# EAGLE design Charger Control Board rev8 (EAGLE 9.6.2)

## Sheet 1 of 3: Main
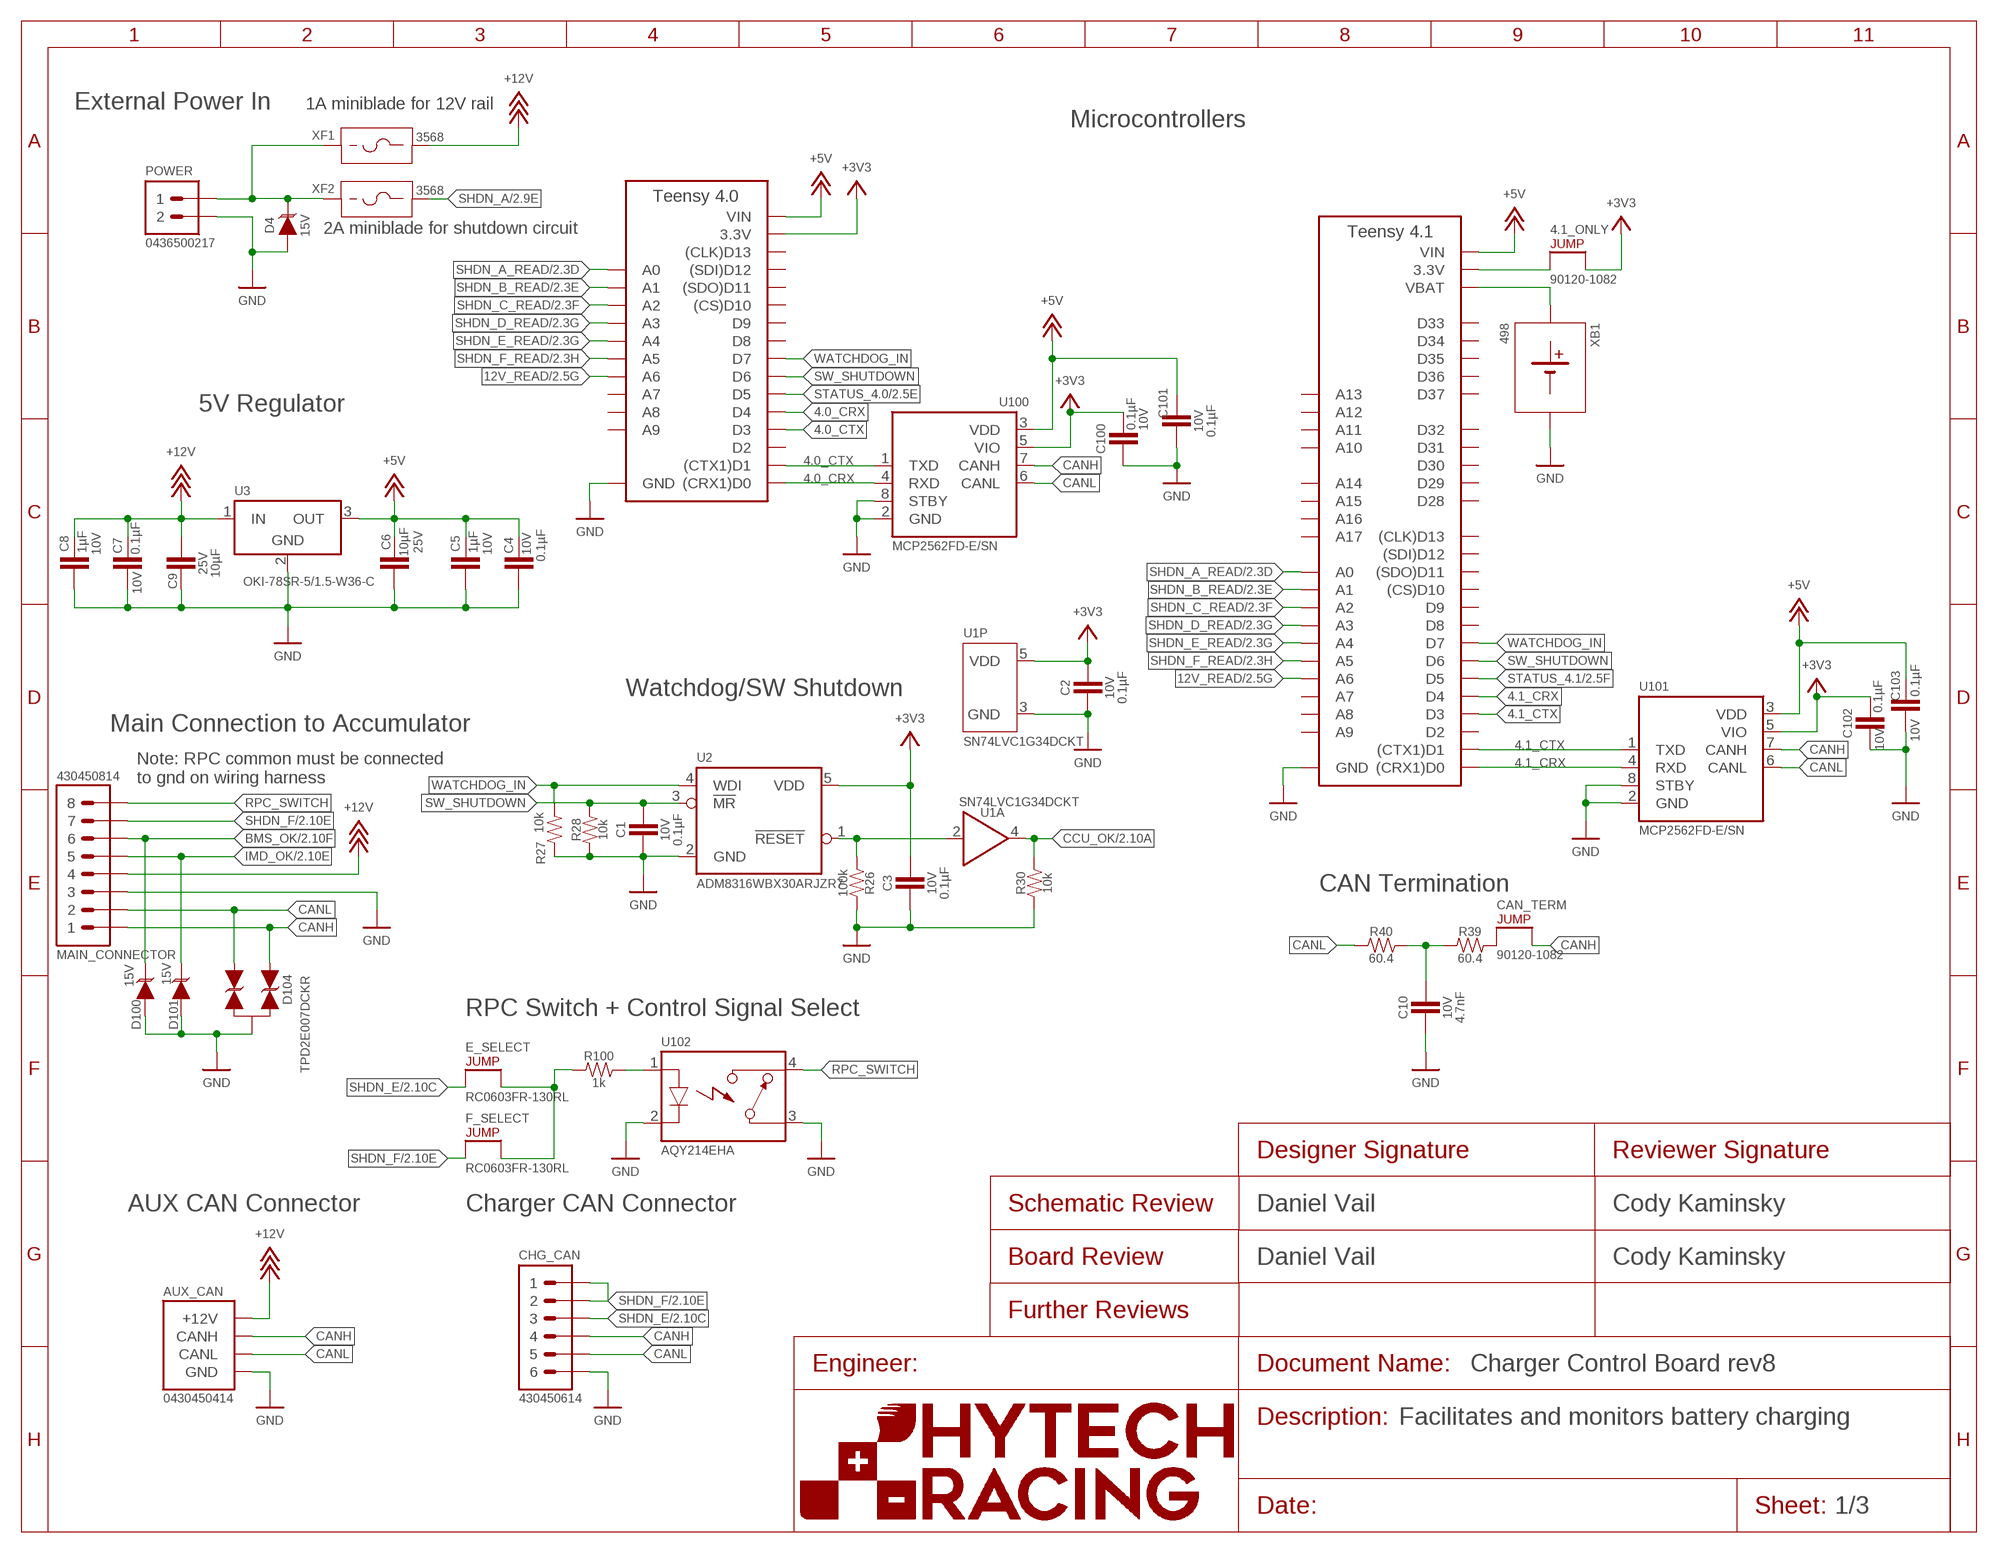
[diagram p0: schematic, sheet 1]
FRAME1 (FRAME): DESCRIPTION_1: Facilitates and monitors battery charging; DESIGNER_BOARD: Daniel Vail; DESIGNER_SCHEMATIC: Daniel Vail; REVIEWER_BOARD: Cody Kaminsky; REVIEWER_SCHEMATIC: Cody Kaminsky

### Parts
4.1_ONLY  JUMPER__1X02  [1X02]
A1  TEENSY_4.1  [TEENSY_LONG_EXT]
A2  TEENSY_4.0  [TEENSY_SHORT]
AUX_CAN  CONNECTOR-CAN_MF_T_V_BLACK  [MOLEX_MICROFIT_PTH_VERTICAL_04_DUAL]
C1  CAPACITOR_0603_10V_0.1UF  [0603-CAP]
C2  CAPACITOR_0603_10V_0.1UF  [0603-CAP]
C3  CAPACITOR_0603_10V_0.1UF  [0603-CAP]
C4  CAPACITOR_0603_10V_0.1UF  [0603-CAP]
C5  CAPACITOR_0603_10V_1UF  [0603-CAP]
C6  CAPACITOR_0603_25V_10UF  [0603-CAP]
C7  CAPACITOR_0603_10V_0.1UF  [0603-CAP]
C8  CAPACITOR_0603_10V_1UF  [0603-CAP]
C9  CAPACITOR_0603_25V_10UF  [0603-CAP]
C10  CAPACITOR_0603_10V_4.7NF  [0603-CAP]
C100  CAPACITOR_0603_10V_0.1UF  [0603-CAP]
C101  CAPACITOR_0603_10V_0.1UF  [0603-CAP]
C102  CAPACITOR_0603_10V_0.1UF  [0603-CAP]
C103  CAPACITOR_0603_10V_0.1UF  [0603-CAP]
CAN_TERM  JUMPER__1X02  [1X02]
CHG_CAN  CONNECTOR-6_MF_T_V_BLACK  [MOLEX_MICROFIT_PTH_VERTICAL_06_DUAL]
D4  TVS_15V  [SOT-23]
D100  TVS_15V  [SOT-23]
D101  TVS_15V  [SOT-23]
D104  TVS_BIDIRECTIONAL_DUAL  [SC-70-3]
E_SELECT  JUMPER_0603_  [0603-RES]
F_SELECT  JUMPER_0603_  [0603-RES]
MAIN_CONNECTOR  CONNECTOR-8_MF_T_V_BLACK  [MOLEX_MICROFIT_PTH_VERTICAL_08_DUAL]
POWER  CONNECTOR-2_MF_T_V_  CONNECTOR-2_MF_T_V_BLACK  [MOLEX_MICROFIT_PTH_VERTICAL_02_SINGLE]
R26  RESISTOR_0603_100K  [0603-RES]
R27  RESISTOR_0603_10K  [0603-RES]
R28  RESISTOR_0603_10K  [0603-RES]
R30  RESISTOR_0603_10K  [0603-RES]
R39  RESISTOR_0603_60.4  [0603-RES]
R40  RESISTOR_0603_60.4  [0603-RES]
R100  RESISTOR_0603_1K  [0603-RES]
U1  LOGICGATE_BUFFER  [SC-70-5]
U2  ADM8316WBX30  [SOT-23-5]
U3  VOLTAGE_REGULATOR_MODULE_OKI-78SR_5V  [OKI-78SR]
U100  MCP2562FD  [SOIC-08(NARROW,0.15")]
U101  MCP2562FD  [SOIC-08(NARROW,0.15")]
U102  RELAY_SOLIDSTATE_NO  [DIP-4]
XB1  BATTERY_HOLDER_KEYSTONE_498  [498]
XF1  FUSE_HOLDER_MINIBLADEPTH  [3568]
XF2  FUSE_HOLDER_MINIBLADEPTH  [3568]

### Nets
4.0_CRX: A2.D0((CRX1)D0) A2.D4 U100.4(RXD)
4.0_CTX: A2.D1((CTX1)D1) A2.D3 U100.1(TXD)
4.1_CRX: A1.D0((CRX1)D0) A1.D4 U101.4(RXD)
4.1_CTX: A1.D1((CTX1)D1) A1.D3 U101.1(TXD)
12V_READ: A1.D20(A6) A2.D20(A6) ; also sheet 2
+3V3: 4.1_ONLY.2 A2.3.3V C2.2 C3.2 C100.2 C102.2 U1.5(P:VDD) U2.5(VDD) U100.5(VIO) U101.5(VIO) ; also sheet 2
+5V: A1.VIN A2.VIN C4.2 C5.1 C6.1 C101.2 C103.2 U3.3(OUT) U100.3(VDD) U101.3(VDD) ; also sheet 2
+12V: AUX_CAN.1(+12V) C7.2 C8.1 C9.1 MAIN_CONNECTOR.4 U3.1(IN) XF1.3 XF1.4 ; also sheet 2
BMS_OK: D100.3(C) MAIN_CONNECTOR.6 ; also sheet 2
CANH: AUX_CAN.4(CANH) CAN_TERM.2 CHG_CAN.4 D104.1(C1) MAIN_CONNECTOR.1 U100.7(CANH) U101.7(CANH)
CANL: AUX_CAN.3(CANL) CHG_CAN.5 D104.2(C2) MAIN_CONNECTOR.2 R40.1 U100.6(CANL) U101.6(CANL)
CCU_OK: R30.2 U1.4(A:OUT) ; also sheet 2
GND: A1.AGND/GND(GND) A1.GND A1.GND@2(GND) A2.AGND/GND(GND) A2.GND AUX_CAN.2(GND) C1.1 C2.1 C3.1 C4.1 C5.2 C6.2 C7.1 C8.2 C9.2 C10.2 C100.1 C101.1 C102.1 C103.1 CHG_CAN.6 D4.1(A) D100.1(A) D101.1(A) D104.3(A) MAIN_CONNECTOR.3 POWER.2 R26.2 R27.2 R28.1 R30.1 U1.3(P:GND) U2.2(GND) U3.2(GND) U100.2(GND) U100.8(STBY) U101.2(GND) U101.8(STBY) U102.2(CONTROL-) U102.3(CONTACT1) XB1.2(MINUS) ; also sheet 2
IMD_OK: D101.3(C) MAIN_CONNECTOR.5 ; also sheet 2
N$1: D4.3(C) POWER.1 XF1.1 XF1.2 XF2.1 XF2.2
N$2: R26.1 U1.2(A:IN) U2.1(!RESET!)
N$4: CAN_TERM.1 R39.2
N$5: E_SELECT.2 F_SELECT.2 R100.1
N$8: A1.VBAT XB1.1(PLUS)
N$9: C10.1 R39.1 R40.2
N$10: R100.2 U102.1(CONTROL+)
N$36: 4.1_ONLY.1 A1.3V3(3.3V) A1.3V3@2(3.3V) A1.3V3@3(3.3V)
RPC_SWITCH: MAIN_CONNECTOR.8 U102.4(CONTACT2)
SHDN_A: XF2.3 XF2.4 ; also sheet 2
SHDN_A_READ: A1.D14(A0) A2.D14(A0) ; also sheet 2
SHDN_B_READ: A1.D15(A1) A2.D15(A1) ; also sheet 2
SHDN_C_READ: A1.D16(A2) A2.D16(A2) ; also sheet 2
SHDN_D_READ: A1.D17(A3) A2.D17(A3) ; also sheet 2
SHDN_E: CHG_CAN.3 E_SELECT.1 ; also sheet 2
SHDN_E_READ: A1.D18(A4) A2.D18(A4) ; also sheet 2
SHDN_F: CHG_CAN.1 CHG_CAN.2 F_SELECT.1 MAIN_CONNECTOR.7 ; also sheet 2
SHDN_F_READ: A1.D19(A5) A2.D19(A5) ; also sheet 2
STATUS_4.0: A2.D5 ; also sheet 2
STATUS_4.1: A1.D5 ; also sheet 2
SW_SHUTDOWN: A1.D6 A2.D6 C1.2 R28.2 U2.3(!MR!)
WATCHDOG_IN: A1.D7 A2.D7 R27.1 U2.4(WDI)
Unconnected: A1.D2 A1.D8 A1.D9 A1.D10((CS)D10) A1.D11((SDO)D11) A1.D12((SDI)D12) A1.D13((CLK)D13) A1.D21(A7) A1.D22(A8) A1.D23(A9) A1.D24(A10) A1.D25(A11) A1.D26(A12) A1.D27(A13) A1.D28 A1.D29 A1.D30 A1.D31 A1.D32 A1.D33 A1.D34 A1.D35 A1.D36 A1.D37 A1.D38(A14) A1.D39(A15) A1.D40(A16) A1.D41(A17) A2.D2 A2.D8 A2.D9 A2.D10((CS)D10) A2.D11((SDO)D11) A2.D12((SDI)D12) A2.D13((CLK)D13) A2.D21(A7) A2.D22(A8) A2.D23(A9)

### Notes on the sheet
- External Power In | 1A miniblade for 12V rail
- Microcontrollers
- 2A miniblade for shutdown circuit
- 5V Regulator
- Watchdog/SW Shutdown
- Main Connection to Accumulator
- Note: RPC common must be connected
  to gnd on wiring harness
- CAN Termination
- RPC Switch + Control Signal Select
- AUX CAN Connector | Charger CAN Connector

## Sheet 2 of 3: Shutdown Cicruit
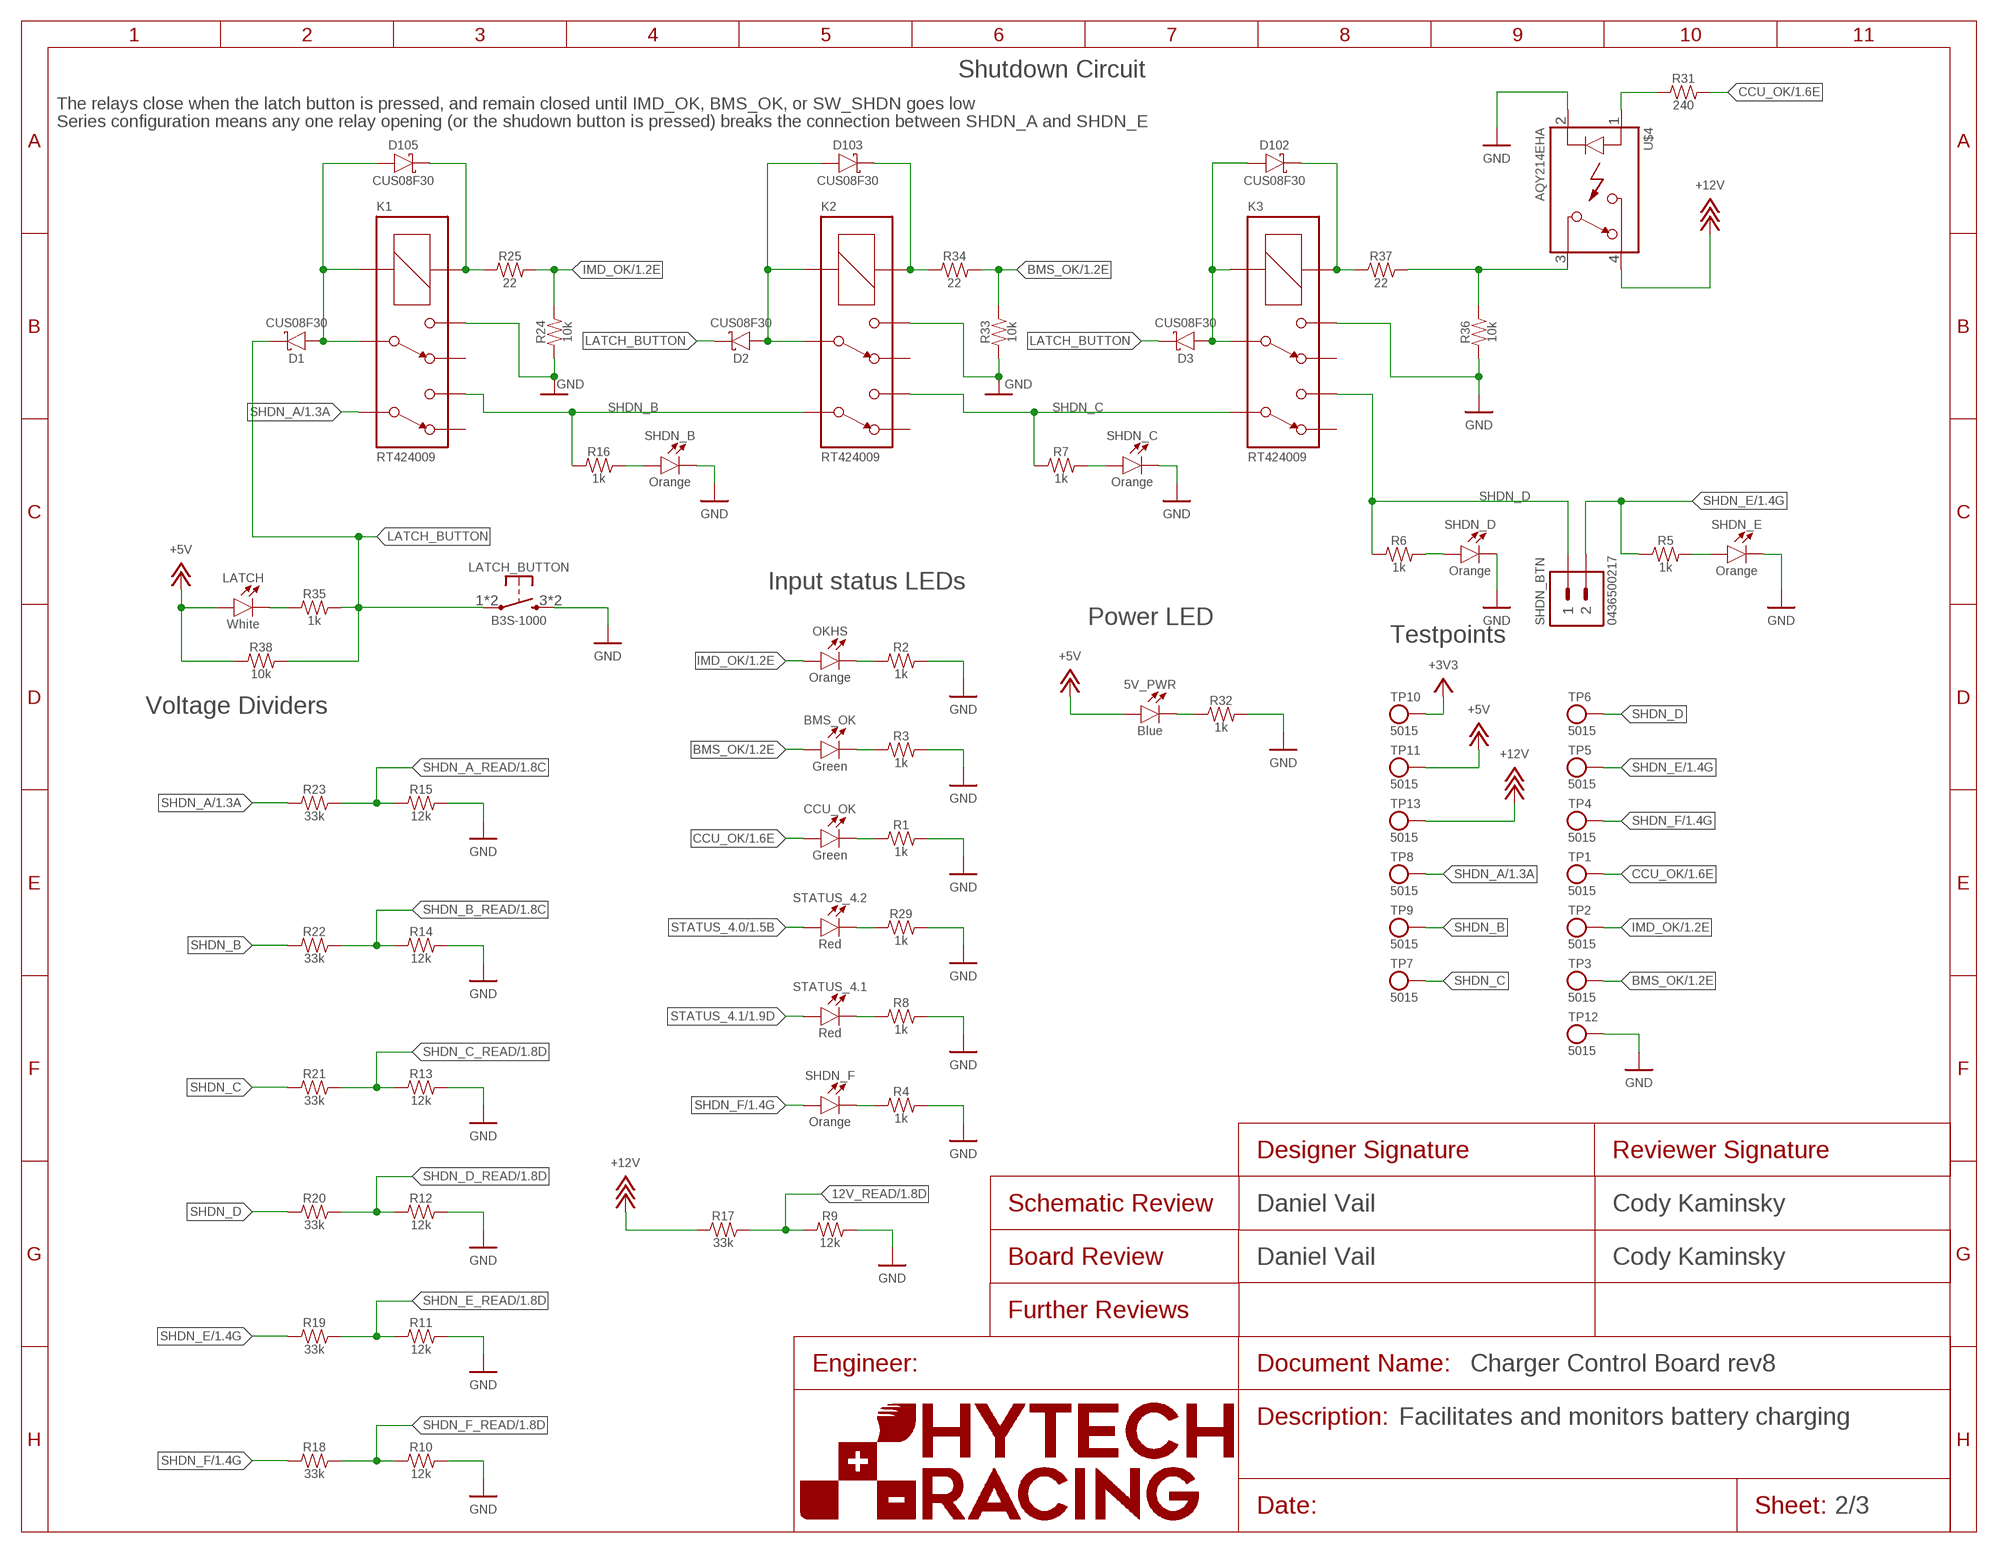
[diagram p1: schematic, sheet 2]
FRAME2 (FRAME): DESCRIPTION_1: Facilitates and monitors battery charging; DESIGNER_BOARD: Daniel Vail; DESIGNER_SCHEMATIC: Daniel Vail; REVIEWER_BOARD: Cody Kaminsky; REVIEWER_SCHEMATIC: Cody Kaminsky

### Parts
5V_PWR  LED_0603_BLUE  [0603-LED]
BMS_OK  LED_0603_GREEN  [0603-LED]
CCU_OK  LED_0603_GREEN  [0603-LED]
D1  SCHOTTKY_SOD323_30V  [SOD-323]
D2  SCHOTTKY_SOD323_30V  [SOD-323]
D3  SCHOTTKY_SOD323_30V  [SOD-323]
D102  SCHOTTKY_SOD323_30V  [SOD-323]
D103  SCHOTTKY_SOD323_30V  [SOD-323]
D105  SCHOTTKY_SOD323_30V  [SOD-323]
K1  RELAY_DPDT  [RT*2*]
K2  RELAY_DPDT  [RT*2*]
K3  RELAY_DPDT  [RT*2*]
LATCH  LED_0603_WHITE  [0603-LED]
LATCH_BUTTON  BUTTON  [B3S-100X]
OKHS  LED_0603_ORANGE  [0603-LED]
R1  RESISTOR_0603_1K  [0603-RES]
R2  RESISTOR_0603_1K  [0603-RES]
R3  RESISTOR_0603_1K  [0603-RES]
R4  RESISTOR_0603_1K  [0603-RES]
R5  RESISTOR_0603_1K  [0603-RES]
R6  RESISTOR_0603_1K  [0603-RES]
R7  RESISTOR_0603_1K  [0603-RES]
R8  RESISTOR_0603_1K  [0603-RES]
R9  RESISTOR_0603_12K  [0603-RES]
R10  RESISTOR_0603_12K  [0603-RES]
R11  RESISTOR_0603_12K  [0603-RES]
R12  RESISTOR_0603_12K  [0603-RES]
R13  RESISTOR_0603_12K  [0603-RES]
R14  RESISTOR_0603_12K  [0603-RES]
R15  RESISTOR_0603_12K  [0603-RES]
R16  RESISTOR_0603_1K  [0603-RES]
R17  RESISTOR_0603_33K  [0603-RES]
R18  RESISTOR_0603_33K  [0603-RES]
R19  RESISTOR_0603_33K  [0603-RES]
R20  RESISTOR_0603_33K  [0603-RES]
R21  RESISTOR_0603_33K  [0603-RES]
R22  RESISTOR_0603_33K  [0603-RES]
R23  RESISTOR_0603_33K  [0603-RES]
R24  RESISTOR_0603_10K  [0603-RES]
R25  RESISTOR_0603_22  [0603-RES]
R29  RESISTOR_0603_1K  [0603-RES]
R31  RESISTOR_0603_240  [0603-RES]
R32  RESISTOR_0603_1K  [0603-RES]
R33  RESISTOR_0603_10K  [0603-RES]
R34  RESISTOR_0603_22  [0603-RES]
R35  RESISTOR_0603_1K  [0603-RES]
R36  RESISTOR_0603_10K  [0603-RES]
R37  RESISTOR_0603_22  [0603-RES]
R38  RESISTOR_0603_10K  [0603-RES]
SHDN_B  LED_0603_ORANGE  [0603-LED]
SHDN_BTN  CONNECTOR-2_MF_T_V_  CONNECTOR-2_MF_T_V_BLACK  [MOLEX_MICROFIT_PTH_VERTICAL_02_SINGLE]
SHDN_C  LED_0603_ORANGE  [0603-LED]
SHDN_D  LED_0603_ORANGE  [0603-LED]
SHDN_E  LED_0603_ORANGE  [0603-LED]
SHDN_F  LED_0603_ORANGE  [0603-LED]
STATUS_4.1  LED_0603_RED  [0603-LED]
STATUS_4.2  LED_0603_RED  [0603-LED]
TP1  TEST_POINT  [5015]
TP2  TEST_POINT  [5015]
TP3  TEST_POINT  [5015]
TP4  TEST_POINT  [5015]
TP5  TEST_POINT  [5015]
TP6  TEST_POINT  [5015]
TP7  TEST_POINT  [5015]
TP8  TEST_POINT  [5015]
TP9  TEST_POINT  [5015]
TP10  TEST_POINT  [5015]
TP11  TEST_POINT  [5015]
TP12  TEST_POINT  [5015]
TP13  TEST_POINT  [5015]
U$4  RELAY_SOLIDSTATE_NO  [DIP-4]

### Nets
12V_READ: R9.1 R17.2 ; also sheet 1
+3V3: TP10.1 ; also sheet 1
+5V: 5V_PWR.2(A) LATCH.2(A) R38.1 TP11.1 ; also sheet 1
+12V: R17.1 TP13.1 U$4.4(CONTACT2) ; also sheet 1
BMS_OK: BMS_OK.2(A) R33.2 R34.2 TP3.1 ; also sheet 1
CCU_OK: CCU_OK.2(A) R31.2 TP1.1 ; also sheet 1
GND: K1.14 K2.14 K3.14 LATCH_BUTTON.3(S) LATCH_BUTTON.4(S) R1.2 R2.2 R3.2 R4.2 R8.2 R9.2 R10.2 R11.2 R12.2 R13.2 R14.2 R15.2 R24.1 R29.2 R32.2 R33.1 R36.1 SHDN_B.1(C) SHDN_C.1(C) SHDN_D.1(C) SHDN_E.1(C) TP12.1 U$4.2(CONTROL-) ; also sheet 1
IMD_OK: OKHS.2(A) R24.2 R25.2 TP2.1 ; also sheet 1
LATCH_BUTTON: D1.C D2.C D3.C LATCH_BUTTON.1(P) LATCH_BUTTON.2(P) R35.2 R38.2
N$3: R4.1 SHDN_F.1(C)
N$6: R31.1 U$4.1(CONTROL+)
N$11: D1.A D105.A K1.11 K1.A2(COIL-)
N$12: D105.C K1.A1(COIL+) R25.1
N$13: D103.C K2.A1(COIL+) R34.1
N$14: D2.A D103.A K2.11 K2.A2(COIL-)
N$15: D102.C K3.A1(COIL+) R37.1
N$16: R36.2 R37.2 U$4.3(CONTACT1)
N$17: LATCH.1(C) R35.1
N$18: R6.2 SHDN_D.2(A)
N$19: R5.2 SHDN_E.2(A)
N$20: D3.A D102.A K3.11 K3.A2(COIL-)
N$22: R7.2 SHDN_C.2(A)
N$23: R16.2 SHDN_B.2(A)
N$29: OKHS.1(C) R2.1
N$30: BMS_OK.1(C) R3.1
N$31: CCU_OK.1(C) R1.1
N$33: R29.1 STATUS_4.2.1(C)
N$35: 5V_PWR.1(C) R32.1
N$39: R8.1 STATUS_4.1.1(C)
SHDN_A: K1.21 R23.1 TP8.1 ; also sheet 1
SHDN_A_READ: R15.1 R23.2 ; also sheet 1
SHDN_B: K1.24 K2.21 R16.1 R22.1 TP9.1
SHDN_B_READ: R14.1 R22.2 ; also sheet 1
SHDN_C: K2.24 K3.21 R7.1 R21.1 TP7.1
SHDN_C_READ: R13.1 R21.2 ; also sheet 1
SHDN_D: K3.24 R6.1 R20.1 SHDN_BTN.1 TP6.1
SHDN_D_READ: R12.1 R20.2 ; also sheet 1
SHDN_E: R5.1 R19.1 SHDN_BTN.2 TP5.1 ; also sheet 1
SHDN_E_READ: R11.1 R19.2 ; also sheet 1
SHDN_F: R18.1 SHDN_F.2(A) TP4.1 ; also sheet 1
SHDN_F_READ: R10.1 R18.2 ; also sheet 1
STATUS_4.0: STATUS_4.2.2(A) ; also sheet 1
STATUS_4.1: STATUS_4.1.2(A) ; also sheet 1
Unconnected: K1.12 K1.22 K2.12 K2.22 K3.12 K3.22

### Notes on the sheet
- Shutdown Circuit
- The relays close when the latch button is pressed, and remain closed until IMD_OK, BMS_OK, or SW_SHDN goes low
- Series configuration means any one relay opening (or the shudown button is pressed) breaks the connection between SHDN_A and SHDN_E
- Input status LEDs
- Power LED
- Testpoints
- Voltage Dividers

## Sheet 3 of 3: Ordering Components
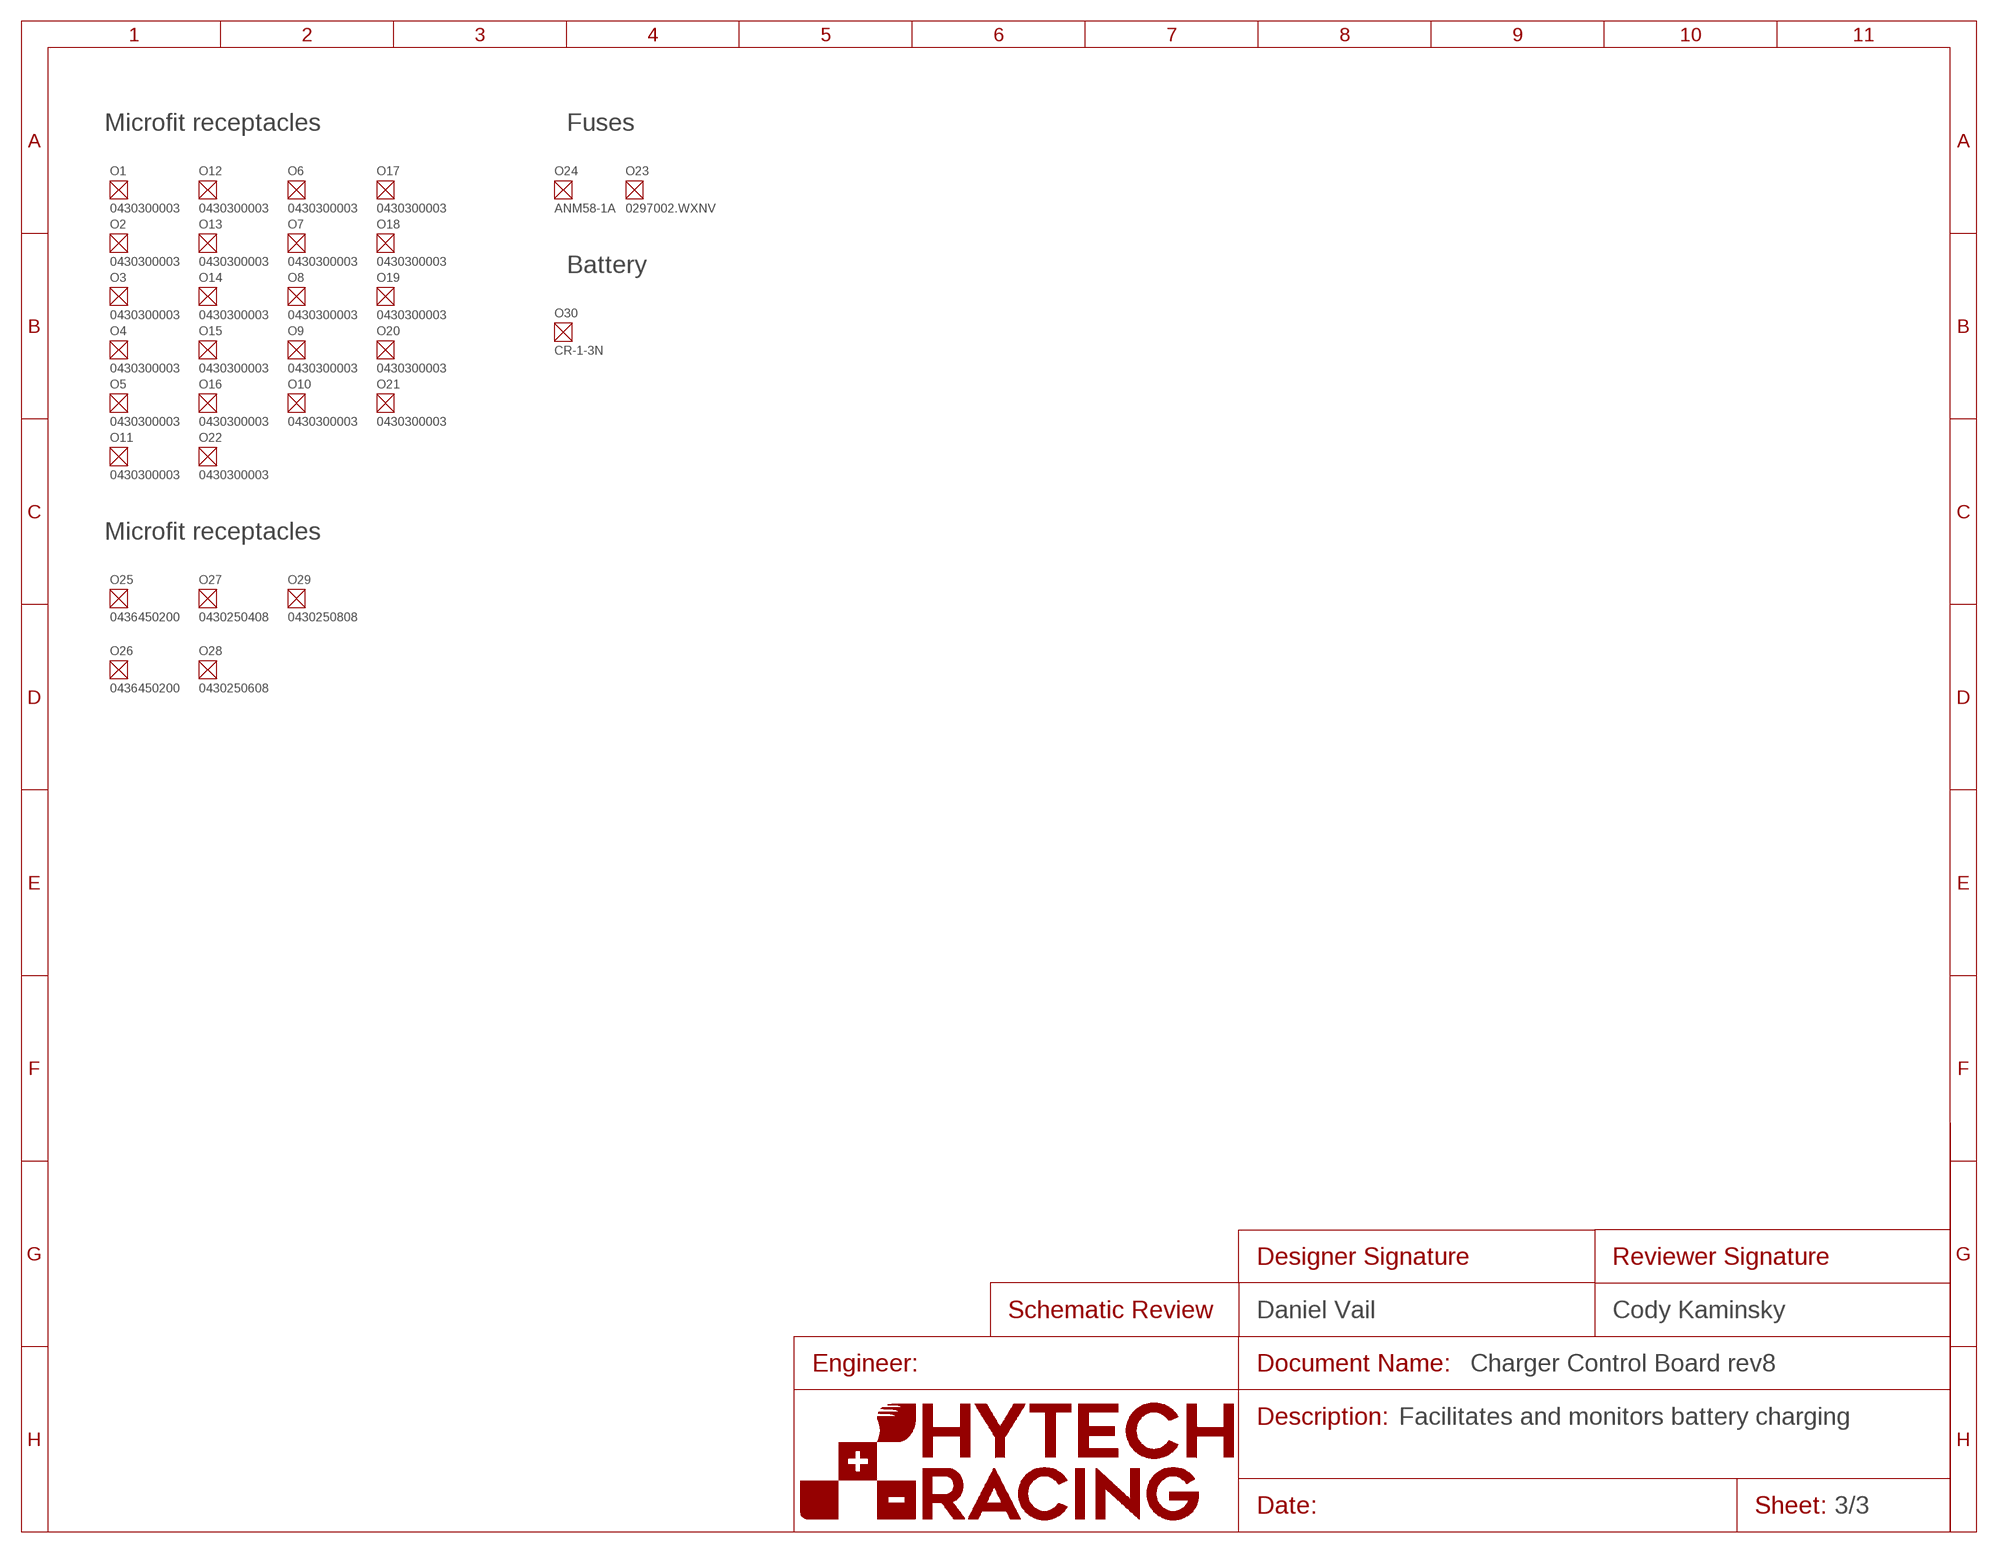
[diagram p2: schematic, sheet 3]
O1 (CRIMP_MICROFIT_20-24): DKPN: WM2776CT-ND; GAUGE: 20-24; MANUFACTURER: Molex; MOPN: 538-43030-0003; MPN: 0430300003
O2 (CRIMP_MICROFIT_20-24): DKPN: WM2776CT-ND; GAUGE: 20-24; MANUFACTURER: Molex; MOPN: 538-43030-0003; MPN: 0430300003
O3 (CRIMP_MICROFIT_20-24): DKPN: WM2776CT-ND; GAUGE: 20-24; MANUFACTURER: Molex; MOPN: 538-43030-0003; MPN: 0430300003
O4 (CRIMP_MICROFIT_20-24): DKPN: WM2776CT-ND; GAUGE: 20-24; MANUFACTURER: Molex; MOPN: 538-43030-0003; MPN: 0430300003
O5 (CRIMP_MICROFIT_20-24): DKPN: WM2776CT-ND; GAUGE: 20-24; MANUFACTURER: Molex; MOPN: 538-43030-0003; MPN: 0430300003
O6 (CRIMP_MICROFIT_20-24): DKPN: WM2776CT-ND; GAUGE: 20-24; MANUFACTURER: Molex; MOPN: 538-43030-0003; MPN: 0430300003
O7 (CRIMP_MICROFIT_20-24): DKPN: WM2776CT-ND; GAUGE: 20-24; MANUFACTURER: Molex; MOPN: 538-43030-0003; MPN: 0430300003
O8 (CRIMP_MICROFIT_20-24): DKPN: WM2776CT-ND; GAUGE: 20-24; MANUFACTURER: Molex; MOPN: 538-43030-0003; MPN: 0430300003
O9 (CRIMP_MICROFIT_20-24): DKPN: WM2776CT-ND; GAUGE: 20-24; MANUFACTURER: Molex; MOPN: 538-43030-0003; MPN: 0430300003
O10 (CRIMP_MICROFIT_20-24): DKPN: WM2776CT-ND; GAUGE: 20-24; MANUFACTURER: Molex; MOPN: 538-43030-0003; MPN: 0430300003
O11 (CRIMP_MICROFIT_20-24): DKPN: WM2776CT-ND; GAUGE: 20-24; MANUFACTURER: Molex; MOPN: 538-43030-0003; MPN: 0430300003
O12 (CRIMP_MICROFIT_20-24): DKPN: WM2776CT-ND; GAUGE: 20-24; MANUFACTURER: Molex; MOPN: 538-43030-0003; MPN: 0430300003
O13 (CRIMP_MICROFIT_20-24): DKPN: WM2776CT-ND; GAUGE: 20-24; MANUFACTURER: Molex; MOPN: 538-43030-0003; MPN: 0430300003
O14 (CRIMP_MICROFIT_20-24): DKPN: WM2776CT-ND; GAUGE: 20-24; MANUFACTURER: Molex; MOPN: 538-43030-0003; MPN: 0430300003
O15 (CRIMP_MICROFIT_20-24): DKPN: WM2776CT-ND; GAUGE: 20-24; MANUFACTURER: Molex; MOPN: 538-43030-0003; MPN: 0430300003
O16 (CRIMP_MICROFIT_20-24): DKPN: WM2776CT-ND; GAUGE: 20-24; MANUFACTURER: Molex; MOPN: 538-43030-0003; MPN: 0430300003
O17 (CRIMP_MICROFIT_20-24): DKPN: WM2776CT-ND; GAUGE: 20-24; MANUFACTURER: Molex; MOPN: 538-43030-0003; MPN: 0430300003
O18 (CRIMP_MICROFIT_20-24): DKPN: WM2776CT-ND; GAUGE: 20-24; MANUFACTURER: Molex; MOPN: 538-43030-0003; MPN: 0430300003
O19 (CRIMP_MICROFIT_20-24): DKPN: WM2776CT-ND; GAUGE: 20-24; MANUFACTURER: Molex; MOPN: 538-43030-0003; MPN: 0430300003
O20 (CRIMP_MICROFIT_20-24): DKPN: WM2776CT-ND; GAUGE: 20-24; MANUFACTURER: Molex; MOPN: 538-43030-0003; MPN: 0430300003
O21 (CRIMP_MICROFIT_20-24): DKPN: WM2776CT-ND; GAUGE: 20-24; MANUFACTURER: Molex; MOPN: 538-43030-0003; MPN: 0430300003
O22 (CRIMP_MICROFIT_20-24): DKPN: WM2776CT-ND; GAUGE: 20-24; MANUFACTURER: Molex; MOPN: 538-43030-0003; MPN: 0430300003
O23 (FUSE_MINI_BLADE_2): CURRENT: 2A; DKPN: F986-ND; FUSE_TYPE: MINI 297; MANUFACTURER: Littelfuse Inc.; MOPN: 576-0297002.WXNV; MPN: 0297002.WXNV
O24 (FUSE_MINI_BLADE_1): DKPN: 2298-ANM58-1A-ND; MANUFACTURER: OptiFuse; MPN: ANM58-1A
O25 (RECEPTACLE-2_MICROFIT): DKPN: WM1845-ND; MANUFACTURER: Molex; MOPN: 538-43645-0200; MPN: 0436450200
O26 (RECEPTACLE-2_MICROFIT): DKPN: WM1845-ND; MANUFACTURER: Molex; MOPN: 538-43645-0200; MPN: 0436450200
O27 (RECEPTACLE-4_MICROFIT): DKPN: WM11225-ND; MANUFACTURER: Molex; MOPN: 538-43025-0408; MPN: 0430250408
O28 (RECEPTACLE-6_MICROFIT): DKPN: WM13209-ND; MANUFACTURER: Molex; MOPN: 538-43025-0608; MPN: 0430250608
O29 (RECEPTACLE-8_MICROFIT): DKPN: WM13210-ND; MANUFACTURER: Molex; MOPN: 538-43025-0808; MPN: 0430250808
O30 (BATTERY_CR-1/3N): BATTERY_TYPE: 1/3N; DKPN: SY100-ND; MANUFACTURER: FDK America, Inc., a member of Fujitsu Group; MOPN: 639-CR1/3N; MPN: CR-1-3N; VOLTAGE: 3V
U$8 (FRAME_SCHEMATIC_ONLY): DESCRIPTION_1: Facilitates and monitors battery charging; DESIGNER_SCHEMATIC: Daniel Vail; REVIEWER_SCHEMATIC: Cody Kaminsky

### Notes on the sheet
- Microfit receptacles | Fuses
- Battery
- Microfit receptacles

## Library data of the parts
4.1_ONLY CAN_TERM = HyTechDevices_Jumper:JUMPER_?_*: 2 Pin Connector; DKPN: WM23656-ND; MANUFACTURER: Molex; MOPN: 538-90120-1082; MPN: 90120-1082
5V_PWR = HyTechDevices:LED_?_*: LED 0603 Blue <https://www.mouser.com/datasheet/2/216/APT1608VBC_D-246010.pdf> Green <https://www.mouser.com/datasheet/2/216/APT1608ZGCK-1173388.pdf> Orange <https://www.mouser.com/datasheet/2/216/APT1608SECK-6197.pdf> Red <https://www.mouser.com/datasheet/2/216/APT1608SECK-J3-PRV-1173336.pdf> White <https://www.mouser.com/datasheet/2/50/SM0603UWC-880813.pdf> Yellow <https://www.mouser.com/datasheet/2/216/APT1608SYCK-J3-PRV-1173311.pdf> 2835 (Series not on Digikey) Lumiled LUXEON 2835 Color Line <https://www.mouser.com/datasheet/2/602/DS236_luxeon_2835_color_line_datasheet-1596094.pdf>; COLOR: Blue; DKPN: 754-1789-1-ND; MANUFACTURER: Kingbright; MOPN: 604-APT1608VBC/D; MPN: APT1608VBC/D
A1 = HyTechDevices:TEENSY_4.1: Teensy 4.1 with VBAT Datasheet <https://www.pjrc.com/store/teensy41.html#pins> Requires ordering of: 2: 24 pin, 0.1" pitch female headers 1: 2 pin, 0.1" pitch female headers; TEENSY: 4.1
A2 = HyTechDevices:TEENSY_4.0: Teensy 4.0 Datasheet <https://www.pjrc.com/store/teensy40.html> Requires ordering of: 2: 14 pin, 0.1" pitch female headers; TEENSY: 4.0
AUX_CAN = HyTechDevices_temp:CONNECTOR-CAN_?_*: HyTech CAN Connector; DKPN: WM1796-ND; MANUFACTURER: Molex; MOPN: 538-43045-0414; MPN: 0430450414
BMS_OK CCU_OK = HyTechDevices:LED_?_*: LED 0603 Blue <https://www.mouser.com/datasheet/2/216/APT1608VBC_D-246010.pdf> Green <https://www.mouser.com/datasheet/2/216/APT1608ZGCK-1173388.pdf> Orange <https://www.mouser.com/datasheet/2/216/APT1608SECK-6197.pdf> Red <https://www.mouser.com/datasheet/2/216/APT1608SECK-J3-PRV-1173336.pdf> White <https://www.mouser.com/datasheet/2/50/SM0603UWC-880813.pdf> Yellow <https://www.mouser.com/datasheet/2/216/APT1608SYCK-J3-PRV-1173311.pdf> 2835 (Series not on Digikey) Lumiled LUXEON 2835 Color Line <https://www.mouser.com/datasheet/2/602/DS236_luxeon_2835_color_line_datasheet-1596094.pdf>; COLOR: Green; DKPN: 754-1790-1-ND; MANUFACTURER: Kingbright; MOPN: 604-APT1608ZGCK; MPN: APT1608ZGCK
C1-C4 C7 C100-C103 = HyTechDevices:CAPACITOR_?_*: Capacitor, Non-Polarized VJ...1BC Series Datasheet <https://www.mouser.com/datasheet/2/427/vjw1bcbascomseries-1762447.pdf> Samsung Datasheet <https://www.mouser.com/datasheet/2/585/MLCC-1837944.pdf> Walsin Datasheet <https://www.mouser.com/datasheet/2/210/WTC_MLCC_General_Purpose-1534899.pdf> GRM188R61A226ME15D <https://www.mouser.com/datasheet/2/281/1/GRM188R61A226ME15_02A-1985787.pdf> GRM188R61E106MA73D <https://www.mouser.com/datasheet/2/281/1/GRM188R61E106MA73_01A-1985806.pdf> 885012006013 <https://www.mouser.com/datasheet/2/445/885012006013-1726946.pdf> 2220Y6300105KXTWS2 <https://www.mouser.com/datasheet/2/218/SMD_High_and_Std_StackiCap_P62-1825512.pdf> Yageo Class 2, X5R <https://www.mouser.com/datasheet/2/447/UPY_GPHC_X5R_4V_to_50V_26-1827097.pdf> TDK C Series <https://www.mouser.com/ProductDetail/TDK/C3216X5R1V226M160AC?qs=%2Fha2pyFadujbcx9jh7lYl%2F4NeMoXFhdc8AqVWNq4wW6M2y7zl6GzBuhgtI0ngznN> AVX Automotive MLCC <https://www.mouser.com/datasheet/2/40/AutoMLCC-777028.pdf> KEMET X7R Series <https://www.mouser.com/datasheet/2/212/KEM_C1002_X7R_SMD-1102033.pdf> Kyocera AVX <https://www.mouser.com/datasheet/2/40/C0GNP0_Dielectric-951274.pdf>; CAPACITANCE: 0.1µF; DKPN: 720-1688-1-ND; MANUFACTURER: Vishay Vitramon; MOPN: 77-VJ0603Y104JXQPBC; MPN: VJ0603Y104JXQPW1BC; TOLERANCE: 5%; VOLTAGE: 10V
C5 C8 = HyTechDevices:CAPACITOR_?_*: Capacitor, Non-Polarized VJ...1BC Series Datasheet <https://www.mouser.com/datasheet/2/427/vjw1bcbascomseries-1762447.pdf> Samsung Datasheet <https://www.mouser.com/datasheet/2/585/MLCC-1837944.pdf> Walsin Datasheet <https://www.mouser.com/datasheet/2/210/WTC_MLCC_General_Purpose-1534899.pdf> GRM188R61A226ME15D <https://www.mouser.com/datasheet/2/281/1/GRM188R61A226ME15_02A-1985787.pdf> GRM188R61E106MA73D <https://www.mouser.com/datasheet/2/281/1/GRM188R61E106MA73_01A-1985806.pdf> 885012006013 <https://www.mouser.com/datasheet/2/445/885012006013-1726946.pdf> 2220Y6300105KXTWS2 <https://www.mouser.com/datasheet/2/218/SMD_High_and_Std_StackiCap_P62-1825512.pdf> Yageo Class 2, X5R <https://www.mouser.com/datasheet/2/447/UPY_GPHC_X5R_4V_to_50V_26-1827097.pdf> TDK C Series <https://www.mouser.com/ProductDetail/TDK/C3216X5R1V226M160AC?qs=%2Fha2pyFadujbcx9jh7lYl%2F4NeMoXFhdc8AqVWNq4wW6M2y7zl6GzBuhgtI0ngznN> AVX Automotive MLCC <https://www.mouser.com/datasheet/2/40/AutoMLCC-777028.pdf> KEMET X7R Series <https://www.mouser.com/datasheet/2/212/KEM_C1002_X7R_SMD-1102033.pdf> Kyocera AVX <https://www.mouser.com/datasheet/2/40/C0GNP0_Dielectric-951274.pdf>; CAPACITANCE: 1µF; DKPN: 311-1796-1-ND; MANUFACTURER: Yageo; MOPN: 603-CC603KRX7R6BB105; MPN: CC0603KRX7R6BB105; TOLERANCE: 10%; VOLTAGE: 10V
C6 C9 = HyTechDevices:CAPACITOR_?_*: Capacitor, Non-Polarized VJ...1BC Series Datasheet <https://www.mouser.com/datasheet/2/427/vjw1bcbascomseries-1762447.pdf> Samsung Datasheet <https://www.mouser.com/datasheet/2/585/MLCC-1837944.pdf> Walsin Datasheet <https://www.mouser.com/datasheet/2/210/WTC_MLCC_General_Purpose-1534899.pdf> GRM188R61A226ME15D <https://www.mouser.com/datasheet/2/281/1/GRM188R61A226ME15_02A-1985787.pdf> GRM188R61E106MA73D <https://www.mouser.com/datasheet/2/281/1/GRM188R61E106MA73_01A-1985806.pdf> 885012006013 <https://www.mouser.com/datasheet/2/445/885012006013-1726946.pdf> 2220Y6300105KXTWS2 <https://www.mouser.com/datasheet/2/218/SMD_High_and_Std_StackiCap_P62-1825512.pdf> Yageo Class 2, X5R <https://www.mouser.com/datasheet/2/447/UPY_GPHC_X5R_4V_to_50V_26-1827097.pdf> TDK C Series <https://www.mouser.com/ProductDetail/TDK/C3216X5R1V226M160AC?qs=%2Fha2pyFadujbcx9jh7lYl%2F4NeMoXFhdc8AqVWNq4wW6M2y7zl6GzBuhgtI0ngznN> AVX Automotive MLCC <https://www.mouser.com/datasheet/2/40/AutoMLCC-777028.pdf> KEMET X7R Series <https://www.mouser.com/datasheet/2/212/KEM_C1002_X7R_SMD-1102033.pdf> Kyocera AVX <https://www.mouser.com/datasheet/2/40/C0GNP0_Dielectric-951274.pdf>; CAPACITANCE: 10µF; DKPN: 490-7202-1-ND; MANUFACTURER: Murata Electronics; MOPN: 81-GRM188R61E106MA3D; MPN: GRM188R61E106MA73D; TOLERANCE: 20%; VOLTAGE: 25V
C10 = HyTechDevices:CAPACITOR_?_*: Capacitor, Non-Polarized VJ...1BC Series Datasheet <https://www.mouser.com/datasheet/2/427/vjw1bcbascomseries-1762447.pdf> Samsung Datasheet <https://www.mouser.com/datasheet/2/585/MLCC-1837944.pdf> Walsin Datasheet <https://www.mouser.com/datasheet/2/210/WTC_MLCC_General_Purpose-1534899.pdf> GRM188R61A226ME15D <https://www.mouser.com/datasheet/2/281/1/GRM188R61A226ME15_02A-1985787.pdf> GRM188R61E106MA73D <https://www.mouser.com/datasheet/2/281/1/GRM188R61E106MA73_01A-1985806.pdf> 885012006013 <https://www.mouser.com/datasheet/2/445/885012006013-1726946.pdf> 2220Y6300105KXTWS2 <https://www.mouser.com/datasheet/2/218/SMD_High_and_Std_StackiCap_P62-1825512.pdf> Yageo Class 2, X5R <https://www.mouser.com/datasheet/2/447/UPY_GPHC_X5R_4V_to_50V_26-1827097.pdf> TDK C Series <https://www.mouser.com/ProductDetail/TDK/C3216X5R1V226M160AC?qs=%2Fha2pyFadujbcx9jh7lYl%2F4NeMoXFhdc8AqVWNq4wW6M2y7zl6GzBuhgtI0ngznN> AVX Automotive MLCC <https://www.mouser.com/datasheet/2/40/AutoMLCC-777028.pdf> KEMET X7R Series <https://www.mouser.com/datasheet/2/212/KEM_C1002_X7R_SMD-1102033.pdf> Kyocera AVX <https://www.mouser.com/datasheet/2/40/C0GNP0_Dielectric-951274.pdf>; CAPACITANCE: 4.7nF; DKPN: 732-7931-1-ND; MANUFACTURER: Würth Elektronik; MOPN: 710-885012206012; MPN: 885012206012; TOLERANCE: 10%; VOLTAGE: 10V
CHG_CAN = HyTechDevices:CONNECTOR-6_?_*: 6 Pin Connector; DKPN: WM1797-ND; MANUFACTURER: Molex; MOPN: 538-43045-0614; MPN: 430450614
D1-D3 D102 D103 D105 = HyTechDevices:SCHOTTKY_?_*: CUS08F30 Shottky Diode Datasheet <https://www.mouser.com/datasheet/2/408/CUS08F30_datasheet_en_20140414-1916097.pdf>; CURRENT: 0.8A; DKPN: CUS08F30H3FTR-ND; MANUFACTURER: Toshiba Semiconductor and Storage; MOPN: 757-CUS08F30H3F; MPN: CUS08F30; VOLTAGE: 30V
D4 D100 D101 = HyTechDevices:TVS_*: TVS Diode GSOT Datasheet <https://www.mouser.com/datasheet/2/427/gsot03-1767593.pdf>; DKPN: GSOT15-E3-08CT-ND; MANUFACTURER: Vishay General Semiconductor - Diodes Division; MOPN: 78-GSOT15-E3-08; MPN: GSOT15-E3-08; VOLTAGE: 15V
D104 = HyTechDevices:TVS_BIDIRECTIONAL_DUAL: Bdirectional TVS for CAN ESD Datasheet <https://www.ti.com/lit/ds/symlink/tpd2e007.pdf?HQS=dis-mous-null-mousermode-dsf-pf-null-wwe&ts=1615155679700&ref_url=https%253A%252F%252Fwww.mouser.com%252F>; DKPN: 296-25281-1-ND; MANUFACTURER: Texas Instruments; MOPN: 595-TPD2E007DCKR; MPN: TPD2E007DCKR
E_SELECT F_SELECT = HyTechDevices_Jumper:JUMPER_?_*: 2 Pin Connector; DKPN: 13-RC0603FR-130RLTR-ND; MANUFACTURER: YAGEO; MOPN: 603-RC0603FR-130RL; MPN: RC0603FR-130RL
K1-K3 = HyTechDevices:RELAY_DPDT: Dual Pole, Dual Throw Relay Datasheet <https://www.mouser.com/datasheet/2/418/5/NG_DS_RT2_1014-572844.pdf>; DKPN: PB2021-ND; MANUFACTURER: TE Connectivity; MOPN: 655-6-1393243-2; MPN: RT424009
LATCH = HyTechDevices:LED_?_*: LED 0603 Blue <https://www.mouser.com/datasheet/2/216/APT1608VBC_D-246010.pdf> Green <https://www.mouser.com/datasheet/2/216/APT1608ZGCK-1173388.pdf> Orange <https://www.mouser.com/datasheet/2/216/APT1608SECK-6197.pdf> Red <https://www.mouser.com/datasheet/2/216/APT1608SECK-J3-PRV-1173336.pdf> White <https://www.mouser.com/datasheet/2/50/SM0603UWC-880813.pdf> Yellow <https://www.mouser.com/datasheet/2/216/APT1608SYCK-J3-PRV-1173311.pdf> 2835 (Series not on Digikey) Lumiled LUXEON 2835 Color Line <https://www.mouser.com/datasheet/2/602/DS236_luxeon_2835_color_line_datasheet-1596094.pdf>; COLOR: White; DKPN: SM0603UWC-ND; MANUFACTURER: Bivar Inc.; MOPN: 749-SM0603UWC; MPN: SM0603UWC
LATCH_BUTTON = HyTechDevices:BUTTON: Button Datasheet <https://www.mouser.com/datasheet/2/307/en_b3s-1221332.pdf>; DKPN: SW415-ND; MANUFACTURER: Omron; MOPN: 653-B3S-1000; MPN: B3S-1000
MAIN_CONNECTOR = HyTechDevices:CONNECTOR-8_?_*: 8 Pin Connector; DKPN: WM1798-ND; MANUFACTURER: Molex; MOPN: 538-43045-0814; MPN: 430450814
OKHS SHDN_B SHDN_C SHDN_D SHDN_E SHDN_F = HyTechDevices:LED_?_*: LED 0603 Blue <https://www.mouser.com/datasheet/2/216/APT1608VBC_D-246010.pdf> Green <https://www.mouser.com/datasheet/2/216/APT1608ZGCK-1173388.pdf> Orange <https://www.mouser.com/datasheet/2/216/APT1608SECK-6197.pdf> Red <https://www.mouser.com/datasheet/2/216/APT1608SECK-J3-PRV-1173336.pdf> White <https://www.mouser.com/datasheet/2/50/SM0603UWC-880813.pdf> Yellow <https://www.mouser.com/datasheet/2/216/APT1608SYCK-J3-PRV-1173311.pdf> 2835 (Series not on Digikey) Lumiled LUXEON 2835 Color Line <https://www.mouser.com/datasheet/2/602/DS236_luxeon_2835_color_line_datasheet-1596094.pdf>; COLOR: Orange; DKPN: 754-1120-1-ND; MANUFACTURER: Kingbright; MOPN: 604-APT1608SECK; MPN: APT1608SECK
POWER SHDN_BTN = HyTechDevices:CONNECTOR-2_?_*: 2 Pin Connector; DKPN: WM12762-ND; MANUFACTURER: Molex; MOPN: 538-43650-0217; MPN: 0436500217
R1-R8 R16 R29 R32 R35 R100 = HyTechDevices:RESISTOR_?_*: Resistor PWR163 Series <https://www.mouser.com/datasheet/2/54/pwr163-777985.pdf> AC Series <https://www.mouser.com/datasheet/2/447/Yageo_PYu_AC_51_RoHS_L_7_1714230-1874691.pdf> PU Series <https://www.mouser.com/datasheet/2/447/PYu-PU_51_RoHS_L_6-1504619.pdf> ERA Series <https://www.mouser.com/datasheet/2/315/AOA0000C307-1149632.pdf> PWR263 Series <https://www.mouser.com/datasheet/2/54/pwr263s_35-778069.pdf> RC Series <https://www.mouser.com/datasheet/2/447/Yageo_03_18_2021_PYu_RC_Group_51_RoHS_L_11-2199992.pdf> ERJ PB3, PB6 Series <https://www.mouser.com/datasheet/2/315/AOA0000C328-1530132.pdf> ERJ PA2, P03, PA3, P06, P08, P14 Series <https://www.mouser.com/datasheet/2/315/AOA0000C331-1141874.pdf>; DKPN: 311-1.00KHRCT-ND; MANUFACTURER: Yageo; MOPN: 603-RC0603FR-071KL; MPN: RC0603FR-071KL; POWER: 0.1W; RESISTANCE: 1k; TOLERANCE: 1%; VOLTAGE_CONTINUOUS: 10.00V; VOLTAGE_MAX: 75V
R9-R15 = HyTechDevices:RESISTOR_?_*: Resistor PWR163 Series <https://www.mouser.com/datasheet/2/54/pwr163-777985.pdf> AC Series <https://www.mouser.com/datasheet/2/447/Yageo_PYu_AC_51_RoHS_L_7_1714230-1874691.pdf> PU Series <https://www.mouser.com/datasheet/2/447/PYu-PU_51_RoHS_L_6-1504619.pdf> ERA Series <https://www.mouser.com/datasheet/2/315/AOA0000C307-1149632.pdf> PWR263 Series <https://www.mouser.com/datasheet/2/54/pwr263s_35-778069.pdf> RC Series <https://www.mouser.com/datasheet/2/447/Yageo_03_18_2021_PYu_RC_Group_51_RoHS_L_11-2199992.pdf> ERJ PB3, PB6 Series <https://www.mouser.com/datasheet/2/315/AOA0000C328-1530132.pdf> ERJ PA2, P03, PA3, P06, P08, P14 Series <https://www.mouser.com/datasheet/2/315/AOA0000C331-1141874.pdf>; DKPN: 311-12.0KHRCT-ND; MANUFACTURER: Yageo; MOPN: 603-RC0603FR-0712KL; MPN: RC0603FR-0712KL; POWER: 0.1W; RESISTANCE: 12k; TOLERANCE: 1%; VOLTAGE_CONTINUOUS: 34.64V; VOLTAGE_MAX: 75V
R17-R23 = HyTechDevices:RESISTOR_?_*: Resistor PWR163 Series <https://www.mouser.com/datasheet/2/54/pwr163-777985.pdf> AC Series <https://www.mouser.com/datasheet/2/447/Yageo_PYu_AC_51_RoHS_L_7_1714230-1874691.pdf> PU Series <https://www.mouser.com/datasheet/2/447/PYu-PU_51_RoHS_L_6-1504619.pdf> ERA Series <https://www.mouser.com/datasheet/2/315/AOA0000C307-1149632.pdf> PWR263 Series <https://www.mouser.com/datasheet/2/54/pwr263s_35-778069.pdf> RC Series <https://www.mouser.com/datasheet/2/447/Yageo_03_18_2021_PYu_RC_Group_51_RoHS_L_11-2199992.pdf> ERJ PB3, PB6 Series <https://www.mouser.com/datasheet/2/315/AOA0000C328-1530132.pdf> ERJ PA2, P03, PA3, P06, P08, P14 Series <https://www.mouser.com/datasheet/2/315/AOA0000C331-1141874.pdf>; DKPN: 311-33.0KHRTR-ND; MANUFACTURER: Yageo; MOPN: 603-RC0603FR-0733KL; MPN: RC0603FR-0733KL; POWER: 0.1W; RESISTANCE: 33k; TOLERANCE: 1%; VOLTAGE_CONTINUOUS: 57.44V; VOLTAGE_MAX: 75V
R24 R27 R28 R30 R33 R36 R38 = HyTechDevices:RESISTOR_?_*: Resistor PWR163 Series <https://www.mouser.com/datasheet/2/54/pwr163-777985.pdf> AC Series <https://www.mouser.com/datasheet/2/447/Yageo_PYu_AC_51_RoHS_L_7_1714230-1874691.pdf> PU Series <https://www.mouser.com/datasheet/2/447/PYu-PU_51_RoHS_L_6-1504619.pdf> ERA Series <https://www.mouser.com/datasheet/2/315/AOA0000C307-1149632.pdf> PWR263 Series <https://www.mouser.com/datasheet/2/54/pwr263s_35-778069.pdf> RC Series <https://www.mouser.com/datasheet/2/447/Yageo_03_18_2021_PYu_RC_Group_51_RoHS_L_11-2199992.pdf> ERJ PB3, PB6 Series <https://www.mouser.com/datasheet/2/315/AOA0000C328-1530132.pdf> ERJ PA2, P03, PA3, P06, P08, P14 Series <https://www.mouser.com/datasheet/2/315/AOA0000C331-1141874.pdf>; DKPN: 311-10.0KHRCT-ND; MANUFACTURER: Yageo; MOPN: 603-RC0603FR-0710KL; MPN: RC0603FR-0710KL; POWER: 0.1W; RESISTANCE: 10k; TOLERANCE: 1%; VOLTAGE_CONTINUOUS: 31.62V; VOLTAGE_MAX: 75V
R25 R34 R37 = HyTechDevices:RESISTOR_?_*: Resistor PWR163 Series <https://www.mouser.com/datasheet/2/54/pwr163-777985.pdf> AC Series <https://www.mouser.com/datasheet/2/447/Yageo_PYu_AC_51_RoHS_L_7_1714230-1874691.pdf> PU Series <https://www.mouser.com/datasheet/2/447/PYu-PU_51_RoHS_L_6-1504619.pdf> ERA Series <https://www.mouser.com/datasheet/2/315/AOA0000C307-1149632.pdf> PWR263 Series <https://www.mouser.com/datasheet/2/54/pwr263s_35-778069.pdf> RC Series <https://www.mouser.com/datasheet/2/447/Yageo_03_18_2021_PYu_RC_Group_51_RoHS_L_11-2199992.pdf> ERJ PB3, PB6 Series <https://www.mouser.com/datasheet/2/315/AOA0000C328-1530132.pdf> ERJ PA2, P03, PA3, P06, P08, P14 Series <https://www.mouser.com/datasheet/2/315/AOA0000C331-1141874.pdf>; DKPN: 311-22.0HRCT-ND; MANUFACTURER: Yageo; MOPN: 603-RC0603FR-0722RL; MPN: RC0603FR-0722RL; POWER: 0.1W; RESISTANCE: 22; TOLERANCE: 1%; VOLTAGE_CONTINUOUS: 1.48V; VOLTAGE_MAX: 75V
R26 = HyTechDevices:RESISTOR_?_*: Resistor PWR163 Series <https://www.mouser.com/datasheet/2/54/pwr163-777985.pdf> AC Series <https://www.mouser.com/datasheet/2/447/Yageo_PYu_AC_51_RoHS_L_7_1714230-1874691.pdf> PU Series <https://www.mouser.com/datasheet/2/447/PYu-PU_51_RoHS_L_6-1504619.pdf> ERA Series <https://www.mouser.com/datasheet/2/315/AOA0000C307-1149632.pdf> PWR263 Series <https://www.mouser.com/datasheet/2/54/pwr263s_35-778069.pdf> RC Series <https://www.mouser.com/datasheet/2/447/Yageo_03_18_2021_PYu_RC_Group_51_RoHS_L_11-2199992.pdf> ERJ PB3, PB6 Series <https://www.mouser.com/datasheet/2/315/AOA0000C328-1530132.pdf> ERJ PA2, P03, PA3, P06, P08, P14 Series <https://www.mouser.com/datasheet/2/315/AOA0000C331-1141874.pdf>; DKPN: 311-100KHRTR-ND; MANUFACTURER: Yageo; MOPN: 603-RC0603FR-07100KL; MPN: RC0603FR-07100KL; POWER: 0.1W; RESISTANCE: 100k; TOLERANCE: 1%; VOLTAGE_CONTINUOUS: 75V; VOLTAGE_MAX: 75V
R31 = HyTechDevices:RESISTOR_?_*: Resistor PWR163 Series <https://www.mouser.com/datasheet/2/54/pwr163-777985.pdf> AC Series <https://www.mouser.com/datasheet/2/447/Yageo_PYu_AC_51_RoHS_L_7_1714230-1874691.pdf> PU Series <https://www.mouser.com/datasheet/2/447/PYu-PU_51_RoHS_L_6-1504619.pdf> ERA Series <https://www.mouser.com/datasheet/2/315/AOA0000C307-1149632.pdf> PWR263 Series <https://www.mouser.com/datasheet/2/54/pwr263s_35-778069.pdf> RC Series <https://www.mouser.com/datasheet/2/447/Yageo_03_18_2021_PYu_RC_Group_51_RoHS_L_11-2199992.pdf> ERJ PB3, PB6 Series <https://www.mouser.com/datasheet/2/315/AOA0000C328-1530132.pdf> ERJ PA2, P03, PA3, P06, P08, P14 Series <https://www.mouser.com/datasheet/2/315/AOA0000C331-1141874.pdf>; DKPN: 311-240HRCT-ND; MANUFACTURER: Yageo; MOPN: 603-RC0603FR-07240RL; MPN: RC0603FR-07240RL; POWER: 0.1W; RESISTANCE: 240; TOLERANCE: 1%; VOLTAGE_CONTINUOUS: 4.90V; VOLTAGE_MAX: 75V
R39 R40 = HyTechDevices:RESISTOR_?_*: Resistor PWR163 Series <https://www.mouser.com/datasheet/2/54/pwr163-777985.pdf> AC Series <https://www.mouser.com/datasheet/2/447/Yageo_PYu_AC_51_RoHS_L_7_1714230-1874691.pdf> PU Series <https://www.mouser.com/datasheet/2/447/PYu-PU_51_RoHS_L_6-1504619.pdf> ERA Series <https://www.mouser.com/datasheet/2/315/AOA0000C307-1149632.pdf> PWR263 Series <https://www.mouser.com/datasheet/2/54/pwr263s_35-778069.pdf> RC Series <https://www.mouser.com/datasheet/2/447/Yageo_03_18_2021_PYu_RC_Group_51_RoHS_L_11-2199992.pdf> ERJ PB3, PB6 Series <https://www.mouser.com/datasheet/2/315/AOA0000C328-1530132.pdf> ERJ PA2, P03, PA3, P06, P08, P14 Series <https://www.mouser.com/datasheet/2/315/AOA0000C331-1141874.pdf>; DKPN: 311-60.4HRCT-ND; MANUFACTURER: Yageo; MOPN: 603-RC0603FR-0760R4L; MPN: RC0603FR-0760R4L; POWER: 0.1W; RESISTANCE: 60.4; TOLERANCE: 1%; VOLTAGE_CONTINUOUS: 2.48V; VOLTAGE_MAX: 75V
STATUS_4.1 STATUS_4.2 = HyTechDevices:LED_?_*: LED 0603 Blue <https://www.mouser.com/datasheet/2/216/APT1608VBC_D-246010.pdf> Green <https://www.mouser.com/datasheet/2/216/APT1608ZGCK-1173388.pdf> Orange <https://www.mouser.com/datasheet/2/216/APT1608SECK-6197.pdf> Red <https://www.mouser.com/datasheet/2/216/APT1608SECK-J3-PRV-1173336.pdf> White <https://www.mouser.com/datasheet/2/50/SM0603UWC-880813.pdf> Yellow <https://www.mouser.com/datasheet/2/216/APT1608SYCK-J3-PRV-1173311.pdf> 2835 (Series not on Digikey) Lumiled LUXEON 2835 Color Line <https://www.mouser.com/datasheet/2/602/DS236_luxeon_2835_color_line_datasheet-1596094.pdf>; COLOR: Red; DKPN: 754-1786-1-ND; MANUFACTURER: Kingbright; MOPN: 604-APT1608SECKJ3PRV; MPN: APT1608SECK/J3-PRV
TP1 = HyTechDevices:TEST_POINT: Test Point for Probing; DKPN: 36-5015CT-ND; MANUFACTURER: Keystone Electronics; MOPN: 534-5015; MPN: 5015; SIGNAL: CCU_OK
TP2 = HyTechDevices:TEST_POINT: Test Point for Probing; DKPN: 36-5015CT-ND; MANUFACTURER: Keystone Electronics; MOPN: 534-5015; MPN: 5015; SIGNAL: IMD_OK
TP3 = HyTechDevices:TEST_POINT: Test Point for Probing; DKPN: 36-5015CT-ND; MANUFACTURER: Keystone Electronics; MOPN: 534-5015; MPN: 5015; SIGNAL: BMS_OK
TP4 = HyTechDevices:TEST_POINT: Test Point for Probing; DKPN: 36-5015CT-ND; MANUFACTURER: Keystone Electronics; MOPN: 534-5015; MPN: 5015; SIGNAL: SHDN_F
TP5 = HyTechDevices:TEST_POINT: Test Point for Probing; DKPN: 36-5015CT-ND; MANUFACTURER: Keystone Electronics; MOPN: 534-5015; MPN: 5015; SIGNAL: SHDN_E
TP6 = HyTechDevices:TEST_POINT: Test Point for Probing; DKPN: 36-5015CT-ND; MANUFACTURER: Keystone Electronics; MOPN: 534-5015; MPN: 5015; SIGNAL: SHDN_D
TP7 = HyTechDevices:TEST_POINT: Test Point for Probing; DKPN: 36-5015CT-ND; MANUFACTURER: Keystone Electronics; MOPN: 534-5015; MPN: 5015; SIGNAL: SHDN_C
TP8 = HyTechDevices:TEST_POINT: Test Point for Probing; DKPN: 36-5015CT-ND; MANUFACTURER: Keystone Electronics; MOPN: 534-5015; MPN: 5015; SIGNAL: SHDN_A
TP9 = HyTechDevices:TEST_POINT: Test Point for Probing; DKPN: 36-5015CT-ND; MANUFACTURER: Keystone Electronics; MOPN: 534-5015; MPN: 5015; SIGNAL: SHDN_B
TP10 = HyTechDevices:TEST_POINT: Test Point for Probing; DKPN: 36-5015CT-ND; MANUFACTURER: Keystone Electronics; MOPN: 534-5015; MPN: 5015; SIGNAL: +3V3
TP11 = HyTechDevices:TEST_POINT: Test Point for Probing; DKPN: 36-5015CT-ND; MANUFACTURER: Keystone Electronics; MOPN: 534-5015; MPN: 5015; SIGNAL: +5V
TP12 = HyTechDevices:TEST_POINT: Test Point for Probing; DKPN: 36-5015CT-ND; MANUFACTURER: Keystone Electronics; MOPN: 534-5015; MPN: 5015; SIGNAL: GND
TP13 = HyTechDevices:TEST_POINT: Test Point for Probing; DKPN: 36-5015CT-ND; MANUFACTURER: Keystone Electronics; MOPN: 534-5015; MPN: 5015; SIGNAL: +12V
U1 = HyTechDevices:LOGICGATE_BUFFER: Buffer SN74LVC Datasheet <https://www.ti.com/lit/ds/symlink/sn74lvc1g34.pdf>; DKPN: 296-26604-2-ND; MANUFACTURER: Texas Instruments; MOPN: 595-SN74LVC1G34DCKT; MPN: SN74LVC1G34DCKT
U2 = HyTechDevices_temp:ADM8316; DKPN: ADM8316WBX30ARJZR7TR-ND; MANUFACTURER: Analog Devices Inc.; MOPN: 584-M8316WBX30ARJZR7; MPN: ADM8316WBX30ARJZR7
U3 = HyTechDevices:VOLTAGE_REGULATOR_MODULE_?_*: Voltage Regulator Modules OKI-78SR Datasheet <https://www.mouser.com/datasheet/2/281/oki-78sr-56393.pdf>; DKPN: 811-2196-5-ND; MANUFACTURER: Murata Power Solutions Inc.; MOPN: 580-OKI78SR5/1.5W36C; MPN: OKI-78SR-5/1.5-W36-C
U100 U101 = HyTechDevices:MCP2562FD: MCP2562FD Can Tranciever Datasheet <https://ww1.microchip.com/downloads/en/DeviceDoc/20005284A.pdf>; ALT_DKPN: MCP2562-E/SN-ND; ALT_MANUFACTURER: Microchip Technology; ALT_MOPN: 579-MCP2562-E/SN; ALT_MPN: MCP2562-E/SN; DKPN: MCP2562FD-E/SN-ND; MANUFACTURER: Microchip Technology; MOPN: 579-MCP2562FD-E/SN; MPN: MCP2562FD-E/SN
U102 U$4 = HyTechDevices_temp:RELAY_SOLIDSTATE_NO: AQY214EH Normally Open Solid State Relay Datasheet <https://www.datasheetq.com/datasheet-download/287654/1/Panasonic/AQY214EH>; DKPN: 255-1436-5-ND; MANUFACTURER: AQY214EHA; MOPN: 769-AQY214EHA; MPN: AQY214EHA
XB1 = HyTechDevices:BATTERY_HOLDER_*: Keystone 498 1/3N Cell Holder PN for the holder; if 1/3N batteries needed, order separately. Datasheet <https://www.mouser.com/datasheet/2/215/98-745913.pdf>; BATTERY_TYPE: 1/3N; DKPN: 36-498-ND; MANUFACTURER: Keystone Electronics; MOPN: 534-498; MPN: 498
XF1 XF2 = HyTechDevices:FUSE_HOLDER_*: Fuse Holder All PNs for the holder; if Miniblade Fuses <https://www.littelfuse.com/media?resourcetype=datasheets&itemid=0f5f58cb-559e-494b-8d53-723f30445ae5&filename=littelfuse-mini-datasheet> needed, order separately. Mini-Blade PTH <https://www.mouser.com/datasheet/2/215/3568-742601.pdf> Mini-Blade SMD <https://www.mouser.com/datasheet/2/215/588-744913.pdf>; DKPN: 36-3568-ND; FUSE_TYPE: MINI 297; MANUFACTURER: Keystone; MOPN: 534-3568; MPN: 3568

## Board
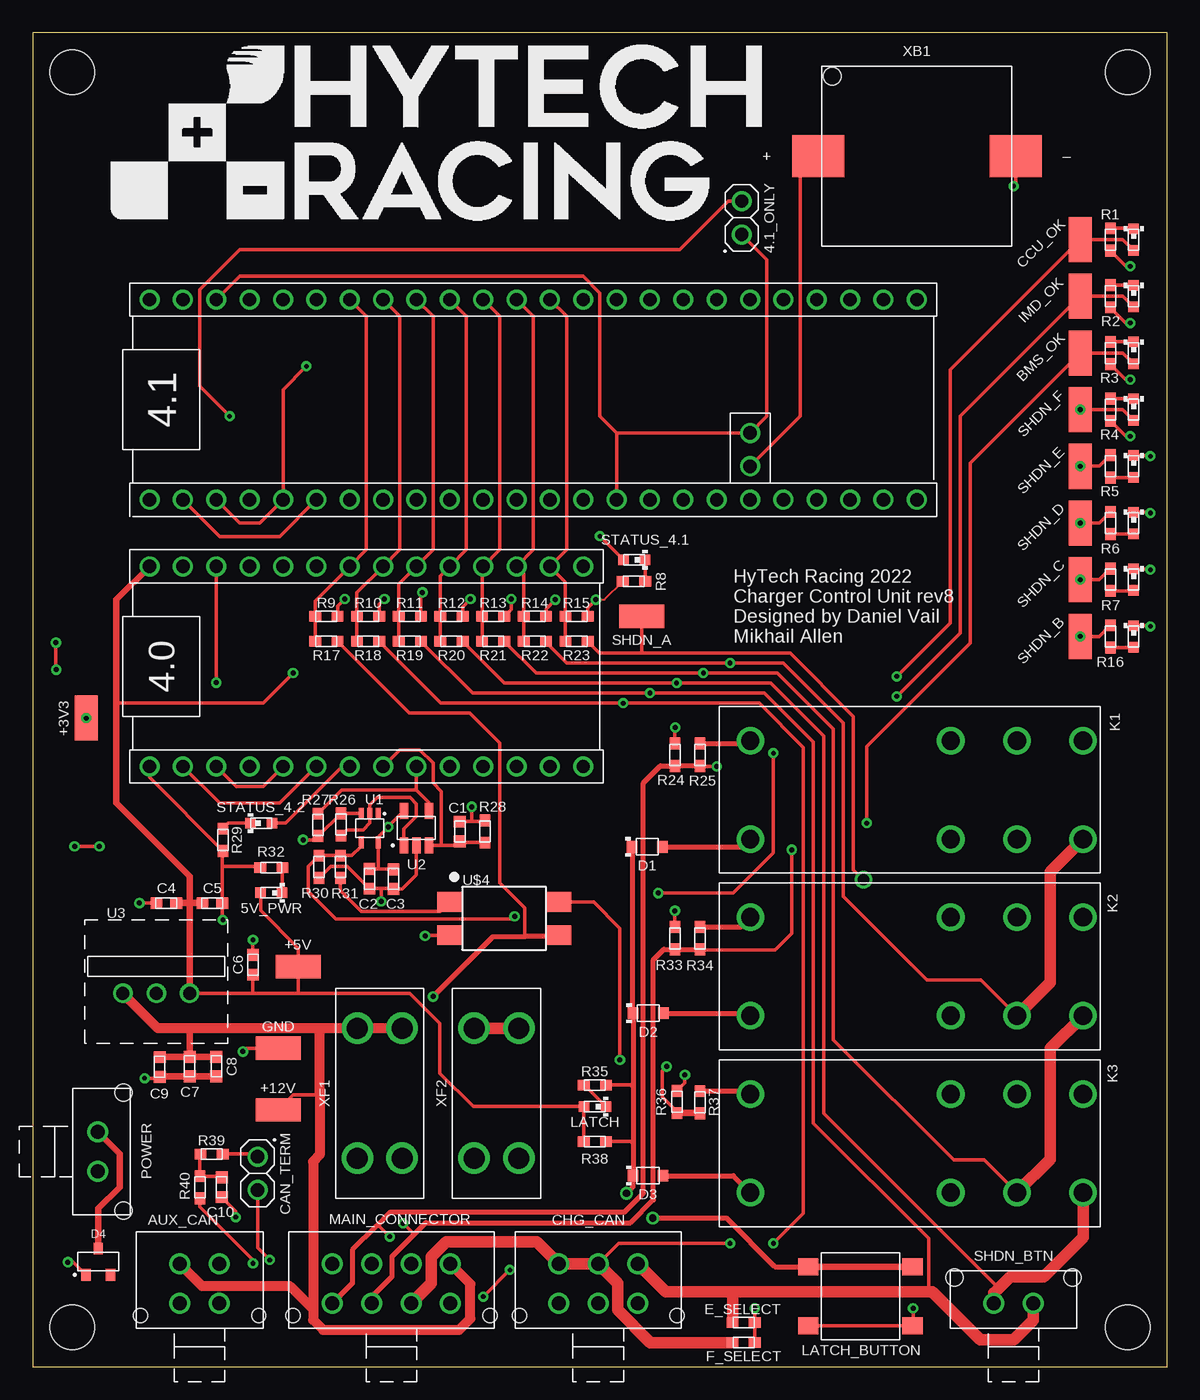
[diagram p3: board, top side]
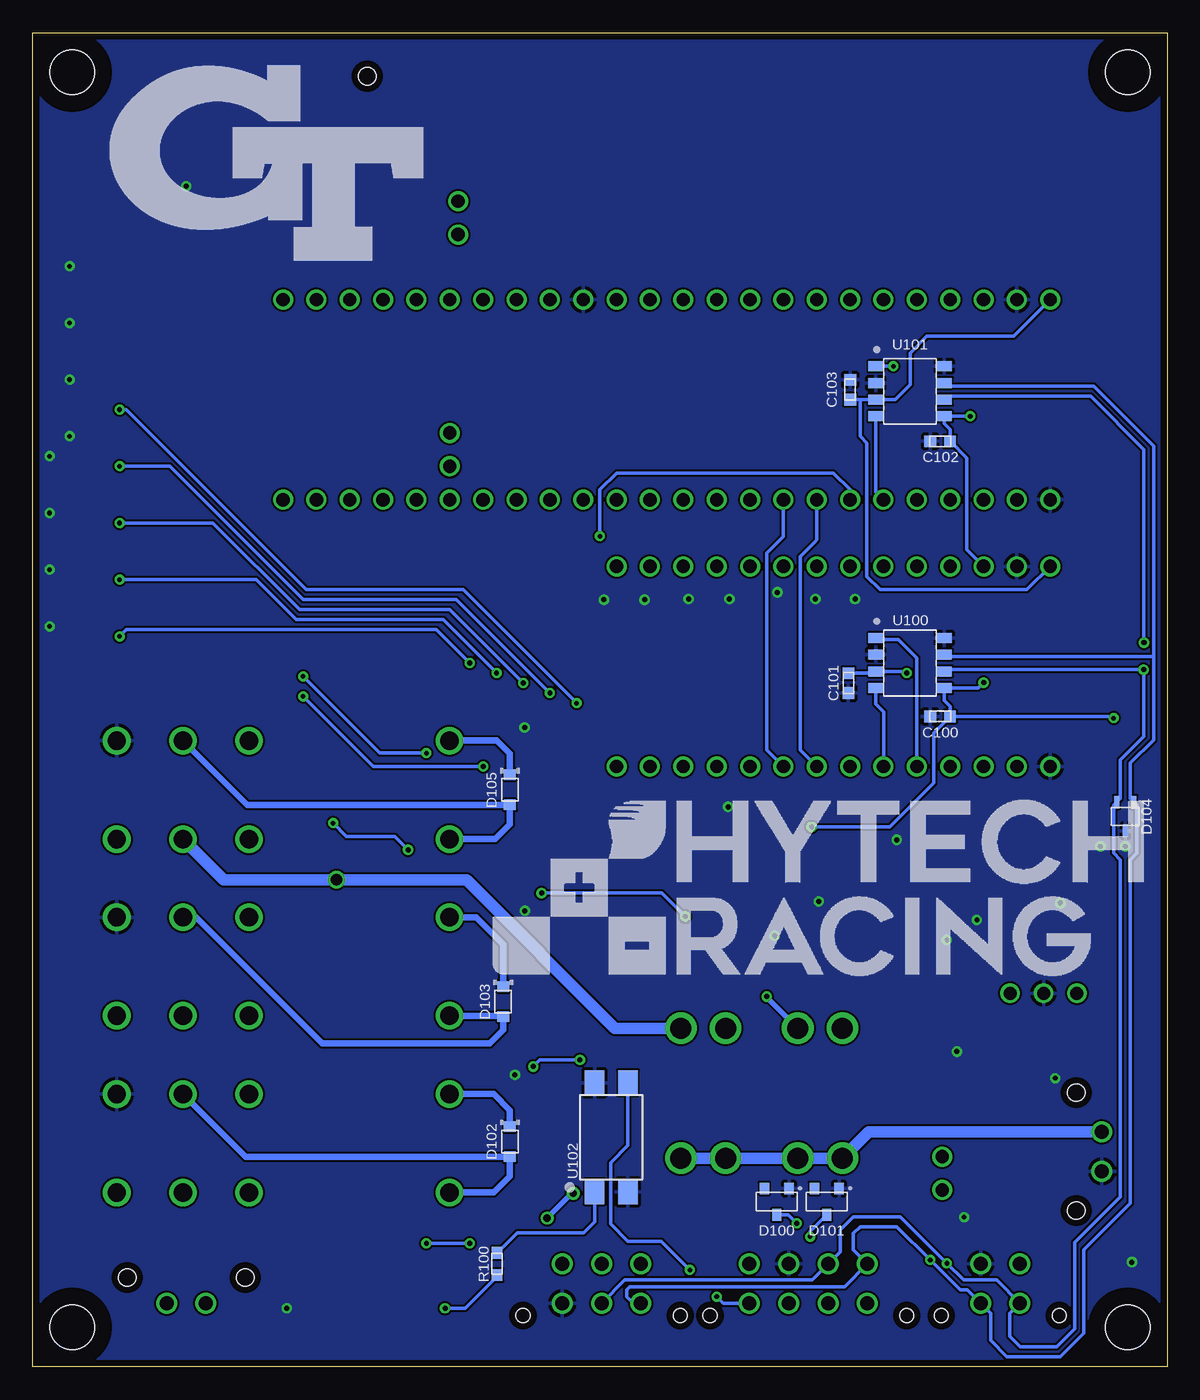
[diagram p4: board, bottom side, seen from below]

Size 86.36 x 101.6 mm. Coordinates in mm from the lower left corner, seen from the top.
Outline: 0,0 86.36,0 86.36,101.6 0,101.6 0,0
Copper layers (1*16): Top 0.035mm / dielectric 1.53mm / Bottom 0.035mm
Design rules "HyTech Default (2 Layer)": minimum track width 6mil, minimum drill 14mil, track to track 6mil, track to pad 6mil, pad to pad 6mil, via to via 20mil, smd to smd 6mil, copper to edge 20mil, drill to drill 21mil, minimum pad ring 7mil, minimum via ring 8mil, stop-mask expansion 6mil, vias tented up to drill 30mil, thermal gap 10mil

### Footprints (pad centres in the part's own frame; a part is rotated, then mirrored left to right if it is on the bottom)
1X02 = drill 1.016: 1 -1.27,0; 2 1.27,0
0603-LED = smd 0.8 x 0.8: 1 -0.825,0; 2 0.825,0
TEENSY_LONG_EXT = drill 1.016: 3V3 0,5.08; 3V3@2 15.24,35.56; 3V3@3 10.16,45.72; AGND/GND 0,2.54; D0 15.24,2.54; D1 15.24,5.08; D2 15.24,7.62; D3 15.24,10.16; D4 15.24,12.7; D5 15.24,15.24; D6 15.24,17.78; D7 15.24,20.32; D8 15.24,22.86; D9 15.24,25.4; D10 15.24,27.94; D11 15.24,30.48; D12 15.24,33.02; D13 0,33.02; D14 0,30.48; D15 0,27.94; D16 0,25.4; D17 0,22.86; D18 0,20.32; D19 0,17.78; D20 0,15.24; D21 0,12.7; D22 0,10.16; D23 0,7.62; D24 15.24,38.1; D25 15.24,40.64; D26 15.24,43.18; D27 15.24,45.72; D28 15.24,48.26; D29 15.24,50.8; D30 15.24,53.34; D31 15.24,55.88; D32 15.24,58.42; D33 0,58.42; D34 0,55.88; D35 0,53.34; D36 0,50.8; D37 0,48.26; D38 0,45.72; D39 0,43.18; D40 0,40.64; D41 0,38.1; GND 15.24,0; GND@2 0,35.56; VBAT 12.7,45.72; VIN 0,0
TEENSY_SHORT = drill 1.016: 3.3V 0,5.08; AGND/GND 0,2.54; D0 15.24,2.54; D1 15.24,5.08; D2 15.24,7.62; D3 15.24,10.16; D4 15.24,12.7; D5 15.24,15.24; D6 15.24,17.78; D7 15.24,20.32; D8 15.24,22.86; D9 15.24,25.4; D10 15.24,27.94; D11 15.24,30.48; D12 15.24,33.02; D13 0,33.02; D14 0,30.48; D15 0,27.94; D16 0,25.4; D17 0,22.86; D18 0,20.32; D19 0,17.78; D20 0,15.24; D21 0,12.7; D22 0,10.16; D23 0,7.62; GND 15.24,0; VIN 0,0
MOLEX_MICROFIT_PTH_VERTICAL_04_DUAL = drill 1.067: 1 1.499,-2.997; 2 -1.499,-2.997; 3 1.499,0; 4 -1.499,0 | hole 1.067: 4.496,0.94; -4.496,0.94
0603-CAP = smd 0.9 x 0.9: 1 -0.75,0; 2 0.75,0
MOLEX_MICROFIT_PTH_VERTICAL_06_DUAL = drill 1.067: 1 2.997,-2.997; 2 0,-2.997; 3 -2.997,-2.997; 4 2.997,0; 5 0,0; 6 -2.997,0 | hole 1.067: 5.994,0.94; -5.994,0.94
SOD-323 = smd 0.8 x 0.9: A -1.15,0; C 1.15,0
SOT-23 = smd 0.711 x 0.889: 1 -0.94,-1.003; 2 0.94,-1.003; 3 0,1.003
SC-70-3 = smd 0.95 x 0.4: 1 -1.1,0.65; 2 -1.1,-0.65; 3 1.1,0
0603-RES = smd 0.9 x 0.8: 1 -0.85,0; 2 0.85,0
RT*2* = drill 1.4: 11 0,3.75; 12 -5.04,3.75; 14 5.04,3.75; 21 0,-3.75; 22 -5.04,-3.75; 24 5.04,-3.75; A1 -20.3,3.75; A2 -20.3,-3.75
B3S-100X = smd 1.55 x 1.3: 1 3.975,-2.25; 2 -3.975,-2.25; 3 3.975,2.25; 4 -3.975,2.25
MOLEX_MICROFIT_PTH_VERTICAL_08_DUAL = drill 1.067: 1 4.496,-2.997; 2 1.499,-2.997; 3 -1.499,-2.997; 4 -4.496,-2.997; 5 4.496,0; 6 1.499,0; 7 -1.499,0; 8 -4.496,0 | hole 1.067: 7.493,0.94; -7.493,0.94
MOLEX_MICROFIT_PTH_VERTICAL_02_SINGLE = drill 1.067: 1 1.499,0; 2 -1.499,0 | hole 1.321: 4.496,-1.956; -4.496,-1.956
5015 = smd 3.429 x 1.778: 1 0,0
SC-70-5 = smd 0.4 x 0.9: 1 -0.65,-1.1; 2 0,-1.1; 3 0.65,-1.1; 4 0.65,1.1; 5 -0.65,1.1
SOT-23-5 = smd 0.62 x 1.22: 1 -0.95,-1.31; 2 0,-1.31; 3 0.95,-1.31; 4 0.95,1.31; 5 -0.95,1.31
OKI-78SR = drill 0.991: 1 -2.54,0; 2 0,0; 3 2.54,0
SOIC-08(NARROW,0.15") = smd 0.762 x 1.143: 1 -1.905,-2.603; 2 -0.635,-2.603; 3 0.635,-2.603; 4 1.905,-2.603; 5 1.905,2.603; 6 0.635,2.603; 7 -0.635,2.603; 8 -1.905,2.603
DIP-4 = smd 1.5 x 1.9: 1 -1.27,-4.15; 2 1.27,-4.15; 3 -1.27,4.15; 4 1.27,4.15
MOUNTING_M3 = hole 3.4: 0,0
498 = smd 3.962 x 3.175: 1 -7.518,0; 2 7.518,0 | hole 1.346: -6.426,6.096
3568 = drill 1.6: 1 -4.953,1.702; 2 -4.953,-1.702; 3 4.953,-1.702; 4 4.953,1.702

### Placement (x,y rotation side)
4.1_ONLY  53.98,87.5 90 top
5V_PWR  18.16,36.09 180 top
A1  8.89,81.28 270 top
A2  8.89,60.96 270 top
AUX_CAN  12.7,4.83 180 top
BMS_OK  83.82,77.22 270 top
C1  32.51,40.77 270 top
C2  25.63,37.16 90 top
C3  27.46,37.13 90 top
C4  10.16,35.31 0 top
C5  13.67,35.31 0 top
C6  16.76,30.61 90 top
C7  11.94,22.86 90 top
C8  13.97,22.86 270 top
C9  9.65,22.83 270 top
C10  14.38,13.67 270 top
C100  17.27,49.53 0 bottom
C101  24.26,52.07 90 bottom
C102  17.27,70.48 0 bottom
C103  24.13,74.42 270 bottom
CAN_TERM  17.12,14.73 270 top
CCU_OK  83.82,85.85 270 top
CHG_CAN  43.05,4.83 180 top
D1  46.79,39.6 180 top
D2  46.86,26.92 180 top
D3  46.84,14.55 180 top
D4  4.98,8 0 top
D100  29.72,12.57 180 bottom
D101  25.91,12.57 180 bottom
D102  50.04,17.14 90 bottom
D103  50.55,27.81 90 bottom
D104  3.17,41.91 270 bottom
D105  50.04,43.94 90 bottom
E_SELECT  54.13,3.38 0 top
F_SELECT  54.13,1.83 0 top
K1  74.93,43.94 0 top
K2  74.93,30.48 0 top
K3  74.93,17.02 0 top
LATCH  42.8,19.81 180 top
LATCH_BUTTON  63.02,5.36 180 top
MAIN_CONNECTOR  27.3,4.83 180 top
OKHS  83.82,81.53 270 top
POWER  4.95,16.38 90 top
R1  82.04,85.85 270 top
R2  82.04,81.53 270 top
R3  82.04,77.22 270 top
R4  82.04,72.9 270 top
R5  82.04,68.58 270 top
R6  82.04,64.26 270 top
R7  82.04,59.94 270 top
R8  45.77,59.82 180 top
R9  22.35,57.15 0 top
R10  25.53,57.15 0 top
R11  28.7,57.15 0 top
R12  31.88,57.15 0 top
R13  35.05,57.15 0 top
R14  38.23,57.15 0 top
R15  41.4,57.15 0 top
R16  82.04,55.63 270 top
R17  22.35,55.24 180 top
R18  25.53,55.24 180 top
R19  28.7,55.24 180 top
R20  31.88,55.24 180 top
R21  35.05,55.24 180 top
R22  38.23,55.24 180 top
R23  41.4,55.24 180 top
R24  48.9,46.61 270 top
R25  50.8,46.61 270 top
R26  23.47,41.3 90 top
R27  21.72,41.27 270 top
R28  34.42,40.77 270 top
R29  14.48,40.13 270 top
R30  21.79,38.07 90 top
R31  23.42,38.07 90 top
R32  18.16,38 180 top
R33  48.9,32.64 270 top
R34  50.8,32.64 270 top
R35  42.8,21.46 0 top
R36  49.05,20.17 270 top
R37  50.8,20.14 270 top
R38  42.8,17.14 0 top
R39  13.61,16.21 0 top
R40  12.73,13.67 90 top
R100  51,7.82 90 bottom
SHDN_B  83.82,55.63 270 top
SHDN_BTN  74.68,4.83 180 top
SHDN_C  83.82,59.94 270 top
SHDN_D  83.82,64.26 270 top
SHDN_E  83.82,68.58 270 top
SHDN_F  83.82,72.9 270 top
STATUS_4.1  45.8,61.47 180 top
STATUS_4.2  17.4,41.4 0 top
TP1  79.76,85.85 90 top
TP2  79.76,81.53 90 top
TP3  79.76,77.22 90 top
TP4  79.76,72.9 90 top
TP5  79.76,68.58 90 top
TP6  79.76,64.26 90 top
TP7  79.76,59.94 270 top
TP8  46.35,57.15 180 top
TP9  79.76,55.63 90 top
TP10  4.06,49.4 90 top
TP11  20.19,30.48 0 top
TP12  18.67,24.26 180 top
TP13  18.67,19.56 0 top
U1  25.65,41.02 180 top
U2  29.21,41.02 0 top
U3  9.4,28.45 0 top
U100  19.56,53.59 270 bottom
U101  19.56,74.3 270 bottom
U102  42.32,17.48 0 bottom
U$1  [MOUNTING_M3]  3,98.6 0 top
U$2  [MOUNTING_M3]  83.36,98.6 0 top
U$3  [LOGO_HYTECH_LARGE]  5.84,87.38 0 top
U$4  35.89,34.14 270 top
U$5  [MOUNTING_M3]  3,3 0 top
U$6  [MOUNTING_M3]  83.36,3 0 top
U$101  [LOGO_HYTECH_LARGE]  51.44,29.84 0 bottom
U$102  [LOGO_GT_LARGE]  68.58,91.69 0 bottom
XB1  67.31,92.2 0 top
XF1  26.42,20.83 90 top
XF2  35.31,20.83 90 top

### Tracks (layer width: path | path; a pad name or v marks a point on that pad's centre or on a via)
4.0_CRX
  Top 0.254: A2.D0 14.22,42.93 18.8,42.93 A2.D4
  Bottom 0.254: U100.4 22.16,50.47 21.58,49.89 21.58,45.73 A2.D4
4.0_CTX
  Top 0.254: A2.D3 17.53,44.2 15.49,44.2 A2.D1
  Bottom 0.254: U100.1 22.04,55.37 20.45,55.37 19.05,53.98 A2.D3
4.1_CRX
  Top 0.254: A1.D4 18.8,63.25 14.22,63.25 A1.D0
  Bottom 0.254: U101.4 22.16,66.61 A1.D4
4.1_CTX  (via drill 0.36)
  Top 0.254: v20.83,76.2 19.05,74.42 A1.D3 17.27,64.26 15.75,64.26 A1.D1
  Bottom 0.254: U101.1 v20.83,76.2
12V_READ
  Top 0.254: R17.2 R9.1 21.5,58.33 A2.D20 25.4,62.23 25.4,80.01 A1.D20
+3V3  (via drill 0.36, 0.38)
  Top 0.254: v13.97,52.09 A2.3.3V | U2.5 27.06,41.13 v27.06,41.11 26.3,40.36 U1.5 26.3,37.92 26.31,37.91 | C2.2 26.31,37.91 | 26.31,37.91 27.43,37.91 C3.2 | v14.99,72.39 12.7,74.68 12.7,82.04 15.75,85.09 49.28,85.09 52.96,88.77 4.1_ONLY.2
  Bottom 0.254: C100.2 16.52,50.3 16.95,50.74 U100.5 14.38,51.69 v13.97,52.09 | C100.2 17.78,48.27 17.78,44.45 21.12,41.11 v27.06,41.11 | A2.3.3V 15.24,62.23 15.24,69.2 C102.2 16.51,70.5 16.51,71.37 16.95,71.82 U101.5 v14.99,72.39 | C100.2 4.19,49.53 TP10.1
  other vias: 4.06,49.4
+5V  (via drill 0.38)
  Top 0.254: v19.81,52.83 17.53,50.55 6.35,50.55 | 20.19,28.45 28.7,28.45 30.99,26.16 30.99,22.35 33.53,19.81 LATCH.2 41.95,19.79 R38.1 | 20.19,28.45 TP11.1 20.19,31.88 17.34,34.73 5V_PWR.2 | 20.19,28.45 16.76,28.45 | 16.76,28.45 U3.3 | C6.1 16.76,28.45
  Top 0.508: C4.2 11.94,35.31 | C5.1 11.94,35.31 | 11.94,35.31 11.94,37.34 6.35,42.93 6.35,50.55 6.35,58.42 A2.VIN | U3.3 11.94,35.31
  Bottom 0.254: C101.2 22.3,52.82 U100.3 19.94,52.96 v19.81,52.83 | A1.VIN 11.68,78.49 18.29,78.49 19.56,77.22 19.56,74.79 20.68,73.66 U101.3 23.37,73.66 | 23.37,73.66 24.12,73.66 C103.2 | A2.VIN 10.67,59.18 21.84,59.18 22.86,60.2 22.86,70.36 23.37,70.87 23.37,73.66
+12V  (via drill 0.38)
  Top 0.254: 37.47,32.77 37.47,34.92 35.56,36.83 35.56,47.5 33.27,49.78 28.66,49.78 R17.1 | TP13.1 19.81,20.7 21.84,20.7
  Top 0.381: v30.48,28.19 35.05,32.77 37.47,32.77 39.94,32.77 U$4.4
  Top 0.508: C7.2 11.94,25.78 | 9.68,23.61 C7.2 | C7.2 C8.1
  Top 0.762: XF1.3 XF1.4 21.84,25.78 | MAIN_CONNECTOR.4 33.33,6.3 33.33,3.67 32.45,2.79 22.1,2.79 21.34,3.56 21.34,4.37 | 21.84,25.78 21.84,20.7 21.84,16.13 21.34,15.62 21.34,4.37 | 21.84,25.78 11.94,25.78 9.53,25.78 U3.1 | AUX_CAN.1 12.87,6.16 19.55,6.16 21.34,4.37 | C9.1 9.68,23.61
  Bottom 0.381: XF1.3 30.48,28.14 v30.48,28.19
BMS_OK  (via drill 0.36, 0.38)
  Top 0.254: v57.78,39.37 57.78,33.02 56.52,31.75 50.84,31.75 R34.2 | BMS_OK.2 83,77.22 TP3.1 71.37,68.83 71.37,55.12 63.5,47.24 v63.5,41.4 | 29.03,10.08 v28.19,10.92
  Top 0.381: R34.2 R33.2 48.05,31.79 47.24,30.99 47.24,12.7 45.52,10.97 29.92,10.97 29.03,10.08 27.33,8.38 27.33,6.86 25.81,5.33 MAIN_CONNECTOR.6
  Bottom 0.254: v63.5,41.4 62.48,40.39 58.8,40.39 v57.78,39.37 | D100.3 28.84,11.57 v28.19,10.92
CANH  (via drill 0.36)
  Top 0.254: CAN_TERM.2 17.12,9.04 v18.03,8.13
  Bottom 0.254: 1.02,54.1 1.02,70.1 5.59,74.68 16.7,74.68 U101.7 | U100.7 16.83,54.1 1.02,54.1 | 1.02,54.1 1.02,47.75 2.79,45.97 2.79,43.28 D104.1 2.29,42.77 2.29,39.12 2.79,38.61 2.79,12.45 6.35,8.89 6.35,2.54 8.13,0.76 12.19,0.76 13.44,2.01 13.44,4.06 AUX_CAN.4 15.21,5.84 15.75,5.84 v18.03,8.13 20.57,10.67 23.37,10.67 23.88,10.16 23.88,8.89 MAIN_CONNECTOR.1 24.54,6.1 40.89,6.1 41.15,5.84 41.15,5.33 40.64,4.83 CHG_CAN.4
CANL  (via drill 0.36, 0.38)
  Top 0.254: v1.75,55.14 1.75,53.11 v1.78,53.09 | v16.76,7.87 16.76,8.13 12.72,12.17 R40.1
  Bottom 0.254: v1.75,55.14 1.75,69.85 5.82,73.91 16.7,73.91 U101.6 | U100.6 16.83,53.09 v1.78,53.09 1.78,48.01 3.56,46.23 3.56,43.28 D104.2 4.06,42.77 4.06,39.12 3.56,38.61 3.56,12.95 7.04,9.47 7.04,2.87 8.38,1.52 11.18,1.52 11.96,2.31 11.96,4.06 AUX_CAN.3 12.98,6.6 15.49,6.6 v16.76,7.87 20.32,11.43 23.88,11.43 24.89,10.41 24.89,8.74 MAIN_CONNECTOR.2 27.03,6.6 41.27,6.6 CHG_CAN.5
CCU_OK  (via drill 0.36, 0.38)
  Top 0.254: U1.4 25,39.63 24.29,38.92 R31.2 R30.2 20.95,38.1 20.95,36.2 23.06,34.09 36.48,34.09 v36.68,34.29 | CCU_OK.2 83,85.85 TP1.1 69.85,75.95 69.85,56.64 v65.79,52.58 | v56.39,46.74 56.39,39.12 53.34,36.07 v47.62,36.07
  Bottom 0.254: v47.62,36.07 38.46,36.07 v36.68,34.29 | v65.79,52.58 59.94,46.74 v56.39,46.74
GND  (via drill 0.36, 0.38)
  Top 0.152: v42.88,58.42 43.52,58.42 R8.2 | R32.2 17.21,38.1
  Top 0.254: U1.3 23.5,42.12 R26.2 21.74,40.42 R27.2 21.42,40.13 v20.57,40.13 | C1.1 33.43,41.52 | 33.43,41.52 34.32,41.52 R28.1 | A2.GND 8.89,44.87 R29.2 14.41,39.22 14.41,38.1 | R30.1 22.67,38.1 23.94,38.1 C2.1 26.52,36.41 | 33.43,41.52 v33.43,42.65 | 26.52,36.41 v26.52,35.43 | R24.1 48.9,48.67 v48.92,48.69 | R33.1 v48.9,34.72 | R36.1 49.66,21.63 v49.66,22.23 | LATCH_BUTTON.3 LATCH_BUTTON.4 67.03,3.15 v67.03,4.45 | R9.2 23.2,57.92 v23.75,58.47 | R10.2 26.38,58.08 v26.77,58.47 | R11.2 29.55,58.86 v29.67,58.98 | R12.2 32.73,57.87 v33.33,58.47 | R13.2 36.42,57.67 v36.42,58.47 | R14.2 39.08,57.72 v39.78,58.42 | R15.2 42.25,57.8 v42.88,58.42 | TP12.1 16.26,24.26 v16,24 | 17.21,38.1 14.41,38.1 | v8.11,35.31 C4.1 | 26.52,36.41 27.43,36.41 C3.1 28.13,36.38 29.21,37.47 U2.2 | U$4.2 29.92,32.87 v29.87,32.82 | 14.41,38.1 C5.2 14.41,34.1 v14.48,34.04 | v85.09,56.39 85.03,56.45 SHDN_B.1 | SHDN_C.1 85.03,60.77 v85.09,60.71 | SHDN_D.1 85.03,65.09 v85.09,65.02 | SHDN_E.1 85.03,69.41 v85.09,69.34 | R4.2 83.22,70.87 v83.57,70.87 | R3.2 83.22,75.18 v83.57,75.18 | R2.2 83.22,79.5 v83.57,79.5 | R1.2 83.22,83.82 v83.57,83.82 | C6.2 v16.76,32.51 | XB1.2 74.83,90.07 v74.68,89.92 | C9.2 9.54,21.97 v8.51,21.97 | C10.2 15.45,11.84 v15.45,11.39 | v3.17,39.62 v5.07,39.62 | D4.1 3.07,7.96 v2.67,7.96
  Top 0.508: 9.68,22.11 C7.1 C8.2
  Top 0.762: C9.2 9.68,22.11
  pour Bottom: -1.27,102.87 -1.27,-1.27 87.63,-1.27 87.63,102.87
IMD_OK  (via drill 0.36)
  Top 0.254: OKHS.2 83,81.53 TP2.1 70.61,72.39 70.61,55.88 v65.79,51.05 | v52.07,45.72 50.84,45.72 R25.2 | 26.14,10.69 26.39,10.69 v27.18,9.91
  Top 0.381: MAIN_CONNECTOR.5 24.33,6.35 24.33,8.89 26.14,10.69 27.23,11.79 45.06,11.79 46.48,13.21 46.48,44.45 47.79,45.76 R24.2 R25.2
  Bottom 0.254: v65.79,51.05 60.45,45.72 v52.07,45.72 | D101.3 27.18,10.3 v27.18,9.91
LATCH_BUTTON  (via drill 0.56)
  Top 0.254: R35.2 45.59,21.46 | R38.2 45.59,17.14 45.71,17.02
  Top 0.381: D1.C 45.64,27 D2.C 45.71,21.34 | 45.71,21.34 45.71,17.02 45.71,14.58 D3.C 45.69,13.68 v45.21,13.21 | v47.2,11.32 52.79,11.32 56.5,7.61 LATCH_BUTTON.1 | 45.59,21.46 45.71,21.34
  Top 0.508: LATCH_BUTTON.2 LATCH_BUTTON.1
  Bottom 0.381: v47.2,11.32 45.31,13.21 v45.21,13.21
N$1
  Top 0.508: D4.3 4.98,12.05 6.6,13.68 6.6,16.23 POWER.1
  Bottom 0.889: XF2.2 XF2.1 XF1.2 XF1.1 22.71,17.88 POWER.1
N$2
  Top 0.254: R26.1 23.91,40.89 25.15,40.89 25.65,41.4 U1.2 25.65,42.8 26.21,43.36 28.73,43.36 29.21,42.88 29.21,41.91 28.26,40.96 U2.1
N$3
  Top 0.254: R4.1 83.8,73.75 SHDN_F.1
N$4
  Top 0.254: R39.2 16.92,16.2 CAN_TERM.1
N$5  (via drill 0.38)
  Top 0.254: F_SELECT.2 E_SELECT.2 54.98,4.43 v54.97,4.45
  Bottom 0.254: v54.97,4.45 53.44,4.45 51,6.88 R100.1
N$6
  Top 0.254: R31.1 23.42,36.27 25.02,34.67 31,34.67 U$4.1
N$8
  Top 0.254: A1.VBAT 58.42,72.39 58.42,90.83 XB1.1
N$9
  Top 0.254: R39.1 12.72,16.17 R40.2 14.28,14.52 C10.1
N$10
  Bottom 0.254: R100.2 49.48,10.2 44.41,10.2 43.59,11.02 U102.1
N$11
  Top 0.381: D1.A 54.04,39.6 K1.A2
  Bottom 0.508: K1.A2 51.16,40.19 50.04,41.32 D105.A 70.03,42.79 K1.11
N$12
  Top 0.254: 54.4,47.46 K1.A1
  Top 0.381: R25.1 54.4,47.46
  Bottom 0.508: D105.C 50.04,46.71 51.02,47.69 K1.A1
N$13
  Top 0.381: R34.1 53.89,33.49 K2.A1
  Bottom 0.508: K2.A1 52.6,34.23 50.55,32.18 D103.C
N$14
  Top 0.381: D2.A 54.44,26.92 K2.A2
  Bottom 0.508: K2.A2 50.61,26.73 D103.A 50.55,25.67 51.59,24.63 64.31,24.63 73.91,34.23 K2.11
N$15
  Top 0.381: R37.1 54.41,20.99 K3.A1
  Bottom 0.508: K3.A1 51.27,20.77 50.04,19.54 D102.C
N$16  (via drill 0.38)
  Top 0.254: v44.7,23.37 44.7,33.4 42.7,35.41 U$4.3 | v48.26,22.86 47.93,22.53 47.93,20.55 49.05,19.43 R36.2
  Top 0.381: 50.77,19.32 R37.2
  Top 0.508: R36.2 50.77,19.32
  Bottom 0.254: v44.7,23.37 47.75,23.37 v48.26,22.86
N$17
  Top 0.254: 41.97,21.46 LATCH.1
  Top 0.381: R35.1 41.97,21.46
N$18
  Top 0.254: R6.2 83.8,63.41 SHDN_D.2
N$19
  Top 0.254: SHDN_E.2 83.8,67.73 R5.2
N$20
  Top 0.381: D3.A 53.34,14.55 K3.A2
  Bottom 0.508: K3.A2 51.28,13.27 50.04,14.51 D102.A 70.16,15.99 K3.11
N$22
  Top 0.254: R7.2 83.8,59.09 SHDN_C.2
N$23
  Top 0.254: SHDN_B.2 83.8,54.78 R16.2
N$29
  Top 0.254: R2.1 83.8,82.38 OKHS.1
N$30
  Top 0.254: BMS_OK.1 83.72,78.14 83.65,78.07 R3.1
N$31
  Top 0.254: R1.1 83.8,86.7 CCU_OK.1
N$33
  Top 0.254: STATUS_4.2.1 14.9,41.4 R29.1
N$35
  Top 0.254: 5V_PWR.1 18.99,37.97 R32.1
N$36
  Top 0.254: A1.3V3 15.75,83.06 41.91,83.06 43.18,81.79 43.18,72.39 44.45,71.12 | 44.45,71.12 A1.3V3@3 55.88,72.39 55.88,84.33 4.1_ONLY.1 | A1.3V3@2 44.45,71.12
N$39
  Top 0.254: STATUS_4.1.1 | STATUS_4.1.1 R8.1
RPC_SWITCH  (via drill 0.36)
  Top 0.254: v34.29,5.33 v36.32,7.37
  Bottom 0.254: U102.4 41.05,16.87 42.37,15.54 42.37,10.87 41.05,9.55 38.51,9.55 v36.32,7.37 | MAIN_CONNECTOR.8 33.78,4.83 v34.29,5.33
SHDN_A  (via drill 0.89)
  Top 0.254: v63.25,37.08 62.48,37.85 62.48,49.53 57.66,54.36 46.48,54.36 | 46.48,54.36 43.14,54.36 R23.1 | TP8.1 46.35,54.48 46.48,54.36
  Top 0.889: XF2.4 XF2.3
  Bottom 0.889: XF2.3 42.04,25.78 53.31,37.06 63.22,37.06 v63.25,37.08 71.82,37.08 K1.21
SHDN_A_READ
  Top 0.254: R23.2 R15.1 40.55,59.78 A2.D14 40.64,62.23 40.64,80.01 A1.D14
SHDN_B  (via drill 0.36)
  Top 0.254: K2.21 72.2,29.46 68.07,29.46 61.72,35.81 61.72,49.02 57.15,53.59 v53.09,53.59 40.64,53.59 39.08,55.16 R22.1 | TP9.1 81.19,55.63 R16.1
  Top 0.889: K1.24 77.47,37.69 77.47,29.27 K2.21
  Bottom 0.254: TP9.1 79.25,56.13 55.63,56.13 v53.09,53.59
  other vias: 79.76,55.63
SHDN_B_READ
  Top 0.254: R22.2 R14.1 37.38,60.41 A2.D15 38.1,62.23 38.1,80.01 A1.D15
SHDN_C  (via drill 0.36)
  Top 0.254: K3.21 72.45,15.75 70.1,15.75 60.96,24.89 60.96,48.56 56.69,52.83 v51.05,52.83 38.31,52.83 R21.1 | TP7.1 81.19,59.94 R7.1
  Top 0.889: K2.24 77.47,24.23 77.47,15.81 K3.21
  Bottom 0.254: TP7.1 69.34,59.94 66.29,56.9 55.12,56.9 v51.05,52.83
  other vias: 79.76,59.94
SHDN_C_READ
  Top 0.254: R21.2 R13.1 34.2,60.87 A2.D16 35.56,62.23 35.56,80.01 A1.D16
SHDN_D  (via drill 0.36)
  Top 0.254: R20.1 35.9,52.07 v49.02,52.07 56.19,52.07 60.21,48.04 60.21,45.69 60.22,45.68 60.22,19.28 73.43,6.07 73.43,5.87 | TP6.1 81.19,64.26 R6.1
  Top 0.889: K3.24 79.97,9.87 76.96,6.86 74.42,6.86 73.43,5.87 73.18,5.61 SHDN_BTN.1
  Bottom 0.254: TP6.1 72.64,64.26 66.04,57.66 54.61,57.66 v49.02,52.07
  other vias: 79.76,64.26
SHDN_D_READ
  Top 0.254: R20.2 R12.1 31.03,60.24 A2.D17 33.02,62.23 33.02,80.01 A1.D17
SHDN_E  (via drill 0.36)
  Top 0.254: R19.1 33.49,51.31 v46.99,51.31 55.7,51.31 59.44,47.57 59.44,18.54 68.2,9.78 68.2,5.82 68.07,5.69 | TP5.1 81.19,68.58 R5.1
  Top 0.889: CHG_CAN.3 48.18,5.69 53.28,5.69 | E_SELECT.1 53.28,5.69 | SHDN_BTN.2 76.17,3.53 74.68,2.03 72.14,2.03 68.48,5.69 68.07,5.69 53.28,5.69
  Bottom 0.254: TP5.1 75.95,68.58 65.79,58.42 54.1,58.42 v46.99,51.31
  other vias: 79.76,68.58
SHDN_E_READ
  Top 0.254: R19.2 R11.1 27.85,59.6 A2.D18 30.48,62.23 30.48,80.01 A1.D18
SHDN_F  (via drill 0.36)
  Top 0.254: R18.1 31.08,50.55 v44.96,50.55 55.3,50.55 58.67,47.17 58.67,11.68 v56.39,9.4 | CHG_CAN.2 44.63,9.4 v53.09,9.4 | TP4.1 83,72.9 SHDN_F.2
  Top 0.889: MAIN_CONNECTOR.7 30.33,6.35 30.33,8.38 31.47,9.53 38.35,9.53 CHG_CAN.1 CHG_CAN.2 44.52,6.36 44.52,4.32 47.01,1.83 F_SELECT.1
  Bottom 0.254: TP4.1 79.25,72.9 65.53,59.18 53.59,59.18 v44.96,50.55 | v53.09,9.4 v56.39,9.4
  other vias: 79.76,72.9
SHDN_F_READ
  Top 0.254: R18.2 R10.1 24.68,58.97 A2.D19 27.94,62.23 27.94,80.01 A1.D19
STATUS_4.0
  Top 0.254: STATUS_4.2.2 19.24,41.4 23.56,45.72 A2.D5
STATUS_4.1  (via drill 0.36)
  Top 0.254: STATUS_4.1.2 v43.18,63.26
  Bottom 0.254: A1.D5 24.13,66.8 25.4,68.07 41.91,68.07 43.18,66.8 v43.18,63.26
SW_SHUTDOWN
  Top 0.254: A2.D6 27.94,46.99 29.46,46.99 30.48,45.97 30.48,44.45 31.11,43.81 31.11,39.71 | R28.2 32.61,39.92 C1.2 32.21,39.71 31.11,39.71 | U2.3 31.11,39.71
  Bottom 0.254: A2.D6 27.94,46.99 27.94,61.72 26.8,62.87 26.67,62.99 A1.D6
WATCHDOG_IN
  Top 0.254: 29.21,43.94 A2.D7 | R27.1 23.53,43.94 29.21,43.94 | U2.4 30.16,42.99 29.21,43.94
  Bottom 0.254: A2.D7 30.48,46.99 30.48,61.98 29.21,63.25 A1.D7

### Text on the board
tPlace: SHDN_C
tNames: HyTech Racing 2022 / Charger Control Unit rev8 / Designed by Daniel Vail / Mikhail Allen